# Altium project FPGA_Rack_v1_0.PrjPcb (part 2 of 2)

## Sheet Memory.SCHDOC: FPGA Rack
size 420 x 297 mm; DrawnBy: zas; Revision: V1.0; SheetNumber: 8; SheetTotal: 25; DocumentName: Memory.SCHDOC
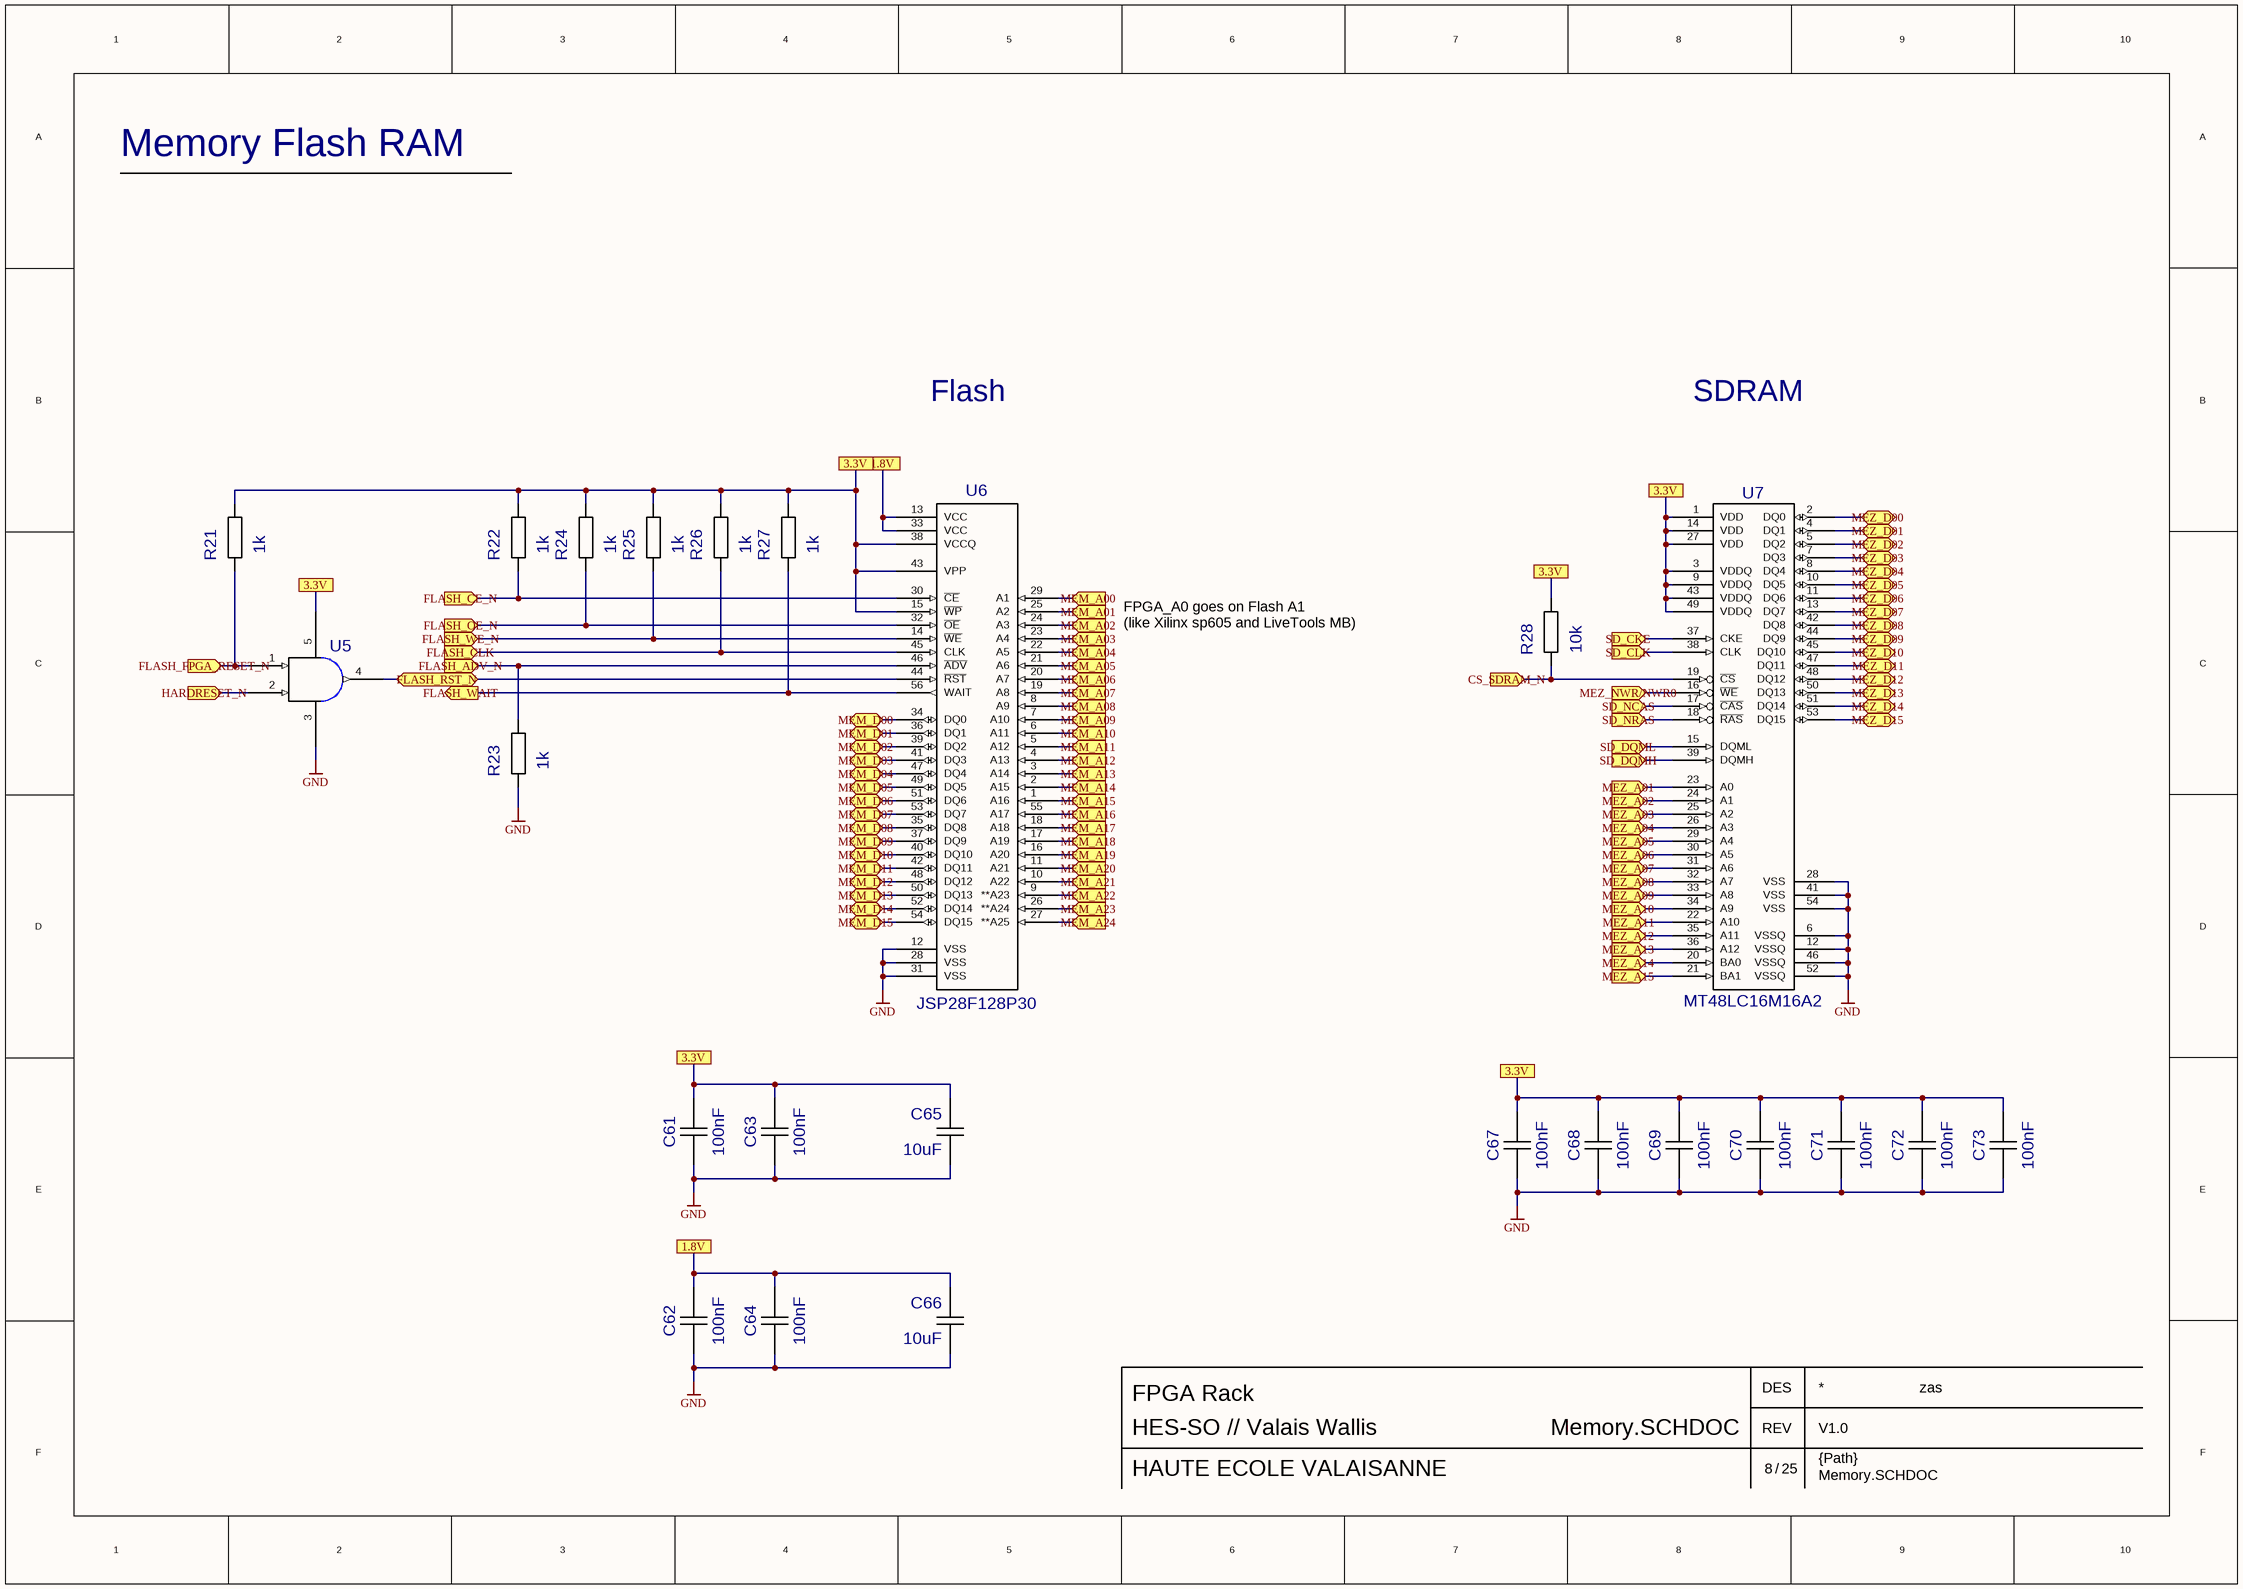
[diagram p8: Memory.SCHDOC]

### Parts
C61  value 100nF  [CC0805-MM]  (hidden comment: CAPS0805-MM)
C62  value 100nF  [CC0805-MM]  (hidden comment: CAPS0805-MM)
C63  value 100nF  [CC0805-MM]  (hidden comment: CAPS0805-MM)
C64  value 100nF  [CC0805-MM]  (hidden comment: CAPS0805-MM)
C65  value 10uF  [CC0805-MM]  (hidden comment: CAPS0805-MM)
C66  value 10uF  [CC0805-MM]  (hidden comment: CAPS0805-MM)
C67  value 100nF  [CC0805-MM]  (hidden comment: CAPS0805-MM)
C68  value 100nF  [CC0805-MM]  (hidden comment: CAPS0805-MM)
C69  value 100nF  [CC0805-MM]  (hidden comment: CAPS0805-MM)
C70  value 100nF  [CC0805-MM]  (hidden comment: CAPS0805-MM)
C71  value 100nF  [CC0805-MM]  (hidden comment: CAPS0805-MM)
C72  value 100nF  [CC0805-MM]  (hidden comment: CAPS0805-MM)
C73  value 100nF  [CC0805-MM]  (hidden comment: CAPS0805-MM)
R21  value 1k  [RC0805-MM]  (hidden comment: RS0805-MM)
R22  value 1k  [RC0805-MM]  (hidden comment: RS0805-MM)
R23  value 1k  [RC0805-MM]  (hidden comment: RS0805-MM)
R24  value 1k  [RC0805-MM]  (hidden comment: RS0805-MM)
R25  value 1k  [RC0805-MM]  (hidden comment: RS0805-MM)
R26  value 1k  [RC0805-MM]  (hidden comment: RS0805-MM)
R27  value 1k  [RC0805-MM]  (hidden comment: RS0805-MM)
R28  value 10k  [RC0805-MM]  (hidden comment: RS0805-MM)
U5  NC7SZ08P5  [SC70-5]  (value not drawn)
U6  value JSP28F128P30  [TSOP56]  (hidden comment: JS28F512P30)
U7  MT48LC16M16A2  [TSOP54]

### Ports
1.8V, 3.3V, CS_SDRAM_N (in), FLASH_ADV_N (in), FLASH_CE_N (in), FLASH_CLK (in), FLASH_FPGA_RESET_N (in), FLASH_OE_N (in), FLASH_RST_N (bidir), FLASH_WAIT (out), FLASH_WE_N (in), HARDRESET_N (in), MEM_A00 (in), MEM_A01 (in), MEM_A02 (in), MEM_A03 (in), MEM_A04 (in), MEM_A05 (in), MEM_A06 (in), MEM_A07 (in), MEM_A08 (in), MEM_A09 (in), MEM_A10 (in), MEM_A11 (in), MEM_A12 (in), MEM_A13 (in), MEM_A14 (in), MEM_A15 (in), MEM_A16 (in), MEM_A17 (in), MEM_A18 (in), MEM_A19 (in), MEM_A20 (in), MEM_A21 (in), MEM_A22 (in), MEM_A23 (in), MEM_A24 (in), MEM_D00 (bidir), MEM_D01 (bidir), MEM_D02 (bidir), MEM_D03 (bidir), MEM_D04 (bidir), MEM_D05 (bidir), MEM_D06 (bidir), MEM_D07 (bidir), MEM_D08 (bidir), MEM_D09 (bidir), MEM_D10 (bidir), MEM_D11 (bidir), MEM_D12 (bidir), MEM_D13 (bidir), MEM_D14 (bidir), MEM_D15 (bidir), MEZ_A01 (in), MEZ_A02 (in), MEZ_A03 (in), MEZ_A04 (in), MEZ_A05 (in), MEZ_A06 (in), MEZ_A07 (in), MEZ_A08 (in), MEZ_A09 (in), MEZ_A10 (in), MEZ_A11 (in), MEZ_A12 (in), MEZ_A13 (in), MEZ_A14 (in), MEZ_A15 (in), MEZ_D00 (bidir), MEZ_D01 (bidir), MEZ_D02 (bidir), MEZ_D03 (bidir), MEZ_D04 (bidir), MEZ_D05 (bidir), MEZ_D06 (bidir), MEZ_D07 (bidir), MEZ_D08 (bidir), MEZ_D09 (bidir), MEZ_D10 (bidir), MEZ_D11 (bidir), MEZ_D12 (bidir), MEZ_D13 (bidir), MEZ_D14 (bidir), MEZ_D15 (bidir), MEZ_NWR/NWR0 (in), SD_CKE (in), SD_CLK (in), SD_DQMH (in), SD_DQML (in), SD_NCAS (in), SD_NRAS (in)

### Nets
GND: C61.1 C62.1 C63.1 C64.1 C65.1 C66.1 C67.1 C68.1 C69.1 C70.1 C71.1 C72.1 C73.1 R23.1 U5.3(GND) U6.12(VSS) U6.28(VSS) U6.31(VSS) U7.6(VSSQ) U7.12(VSSQ) U7.28(VSS) U7.41(VSS) U7.46(VSSQ) U7.52(VSSQ) U7.54(VSS)
CS_SDRAM_N: R28.1 U7.19(~{CS}) ; port CS_SDRAM_N
FLASH_ADV_N: R23.2 U6.46(~{ADV}) ; port FLASH_ADV_N
FLASH_CE_N: R22.1 U6.30(~{CE}) ; port FLASH_CE_N
FLASH_CLK: R26.1 U6.45(CLK) ; port FLASH_CLK
FLASH_FPGA_RESET_N: R21.1 U5.1(A) ; port FLASH_FPGA_RESET_N
FLASH_OE_N: R24.1 U6.32(~{OE}) ; port FLASH_OE_N
FLASH_RST_N: U5.4(Y) U6.44(~{RST}) ; port FLASH_RST_N
FLASH_WAIT: R27.1 U6.56(WAIT) ; port FLASH_WAIT
FLASH_WE_N: R25.1 U6.14(~{WE}) ; port FLASH_WE_N
HARDRESET_N: U5.2(B) ; port HARDRESET_N
MEM_A00: U6.29(A1) ; port MEM_A00
MEM_A01: U6.25(A2) ; port MEM_A01
MEM_A02: U6.24(A3) ; port MEM_A02
MEM_A03: U6.23(A4) ; port MEM_A03
MEM_A04: U6.22(A5) ; port MEM_A04
MEM_A05: U6.21(A6) ; port MEM_A05
MEM_A06: U6.20(A7) ; port MEM_A06
MEM_A07: U6.19(A8) ; port MEM_A07
MEM_A08: U6.8(A9) ; port MEM_A08
MEM_A09: U6.7(A10) ; port MEM_A09
MEM_A10: U6.6(A11) ; port MEM_A10
MEM_A11: U6.5(A12) ; port MEM_A11
MEM_A12: U6.4(A13) ; port MEM_A12
MEM_A13: U6.3(A14) ; port MEM_A13
MEM_A14: U6.2(A15) ; port MEM_A14
MEM_A15: U6.1(A16) ; port MEM_A15
MEM_A16: U6.55(A17) ; port MEM_A16
MEM_A17: U6.18(A18) ; port MEM_A17
MEM_A18: U6.17(A19) ; port MEM_A18
MEM_A19: U6.16(A20) ; port MEM_A19
MEM_A20: U6.11(A21) ; port MEM_A20
MEM_A21: U6.10(A22) ; port MEM_A21
MEM_A22: U6.9(**A23) ; port MEM_A22
MEM_A23: U6.26(**A24) ; port MEM_A23
MEM_A24: U6.27(**A25) ; port MEM_A24
MEM_D00: U6.34(DQ0) ; port MEM_D00
MEM_D01: U6.36(DQ1) ; port MEM_D01
MEM_D02: U6.39(DQ2) ; port MEM_D02
MEM_D03: U6.41(DQ3) ; port MEM_D03
MEM_D04: U6.47(DQ4) ; port MEM_D04
MEM_D05: U6.49(DQ5) ; port MEM_D05
MEM_D06: U6.51(DQ6) ; port MEM_D06
MEM_D07: U6.53(DQ7) ; port MEM_D07
MEM_D08: U6.35(DQ8) ; port MEM_D08
MEM_D09: U6.37(DQ9) ; port MEM_D09
MEM_D10: U6.40(DQ10) ; port MEM_D10
MEM_D11: U6.42(DQ11) ; port MEM_D11
MEM_D12: U6.48(DQ12) ; port MEM_D12
MEM_D13: U6.50(DQ13) ; port MEM_D13
MEM_D14: U6.52(DQ14) ; port MEM_D14
MEM_D15: U6.54(DQ15) ; port MEM_D15
MEZ_A01: U7.23(A0) ; port MEZ_A01
MEZ_A02: U7.24(A1) ; port MEZ_A02
MEZ_A03: U7.25(A2) ; port MEZ_A03
MEZ_A04: U7.26(A3) ; port MEZ_A04
MEZ_A05: U7.29(A4) ; port MEZ_A05
MEZ_A06: U7.30(A5) ; port MEZ_A06
MEZ_A07: U7.31(A6) ; port MEZ_A07
MEZ_A08: U7.32(A7) ; port MEZ_A08
MEZ_A09: U7.33(A8) ; port MEZ_A09
MEZ_A10: U7.34(A9) ; port MEZ_A10
MEZ_A11: U7.22(A10) ; port MEZ_A11
MEZ_A12: U7.35(A11) ; port MEZ_A12
MEZ_A13: U7.36(A12) ; port MEZ_A13
MEZ_A14: U7.20(BA0) ; port MEZ_A14
MEZ_A15: U7.21(BA1) ; port MEZ_A15
MEZ_D00: U7.2(DQ0) ; port MEZ_D00
MEZ_D01: U7.4(DQ1) ; port MEZ_D01
MEZ_D02: U7.5(DQ2) ; port MEZ_D02
MEZ_D03: U7.7(DQ3) ; port MEZ_D03
MEZ_D04: U7.8(DQ4) ; port MEZ_D04
MEZ_D05: U7.10(DQ5) ; port MEZ_D05
MEZ_D06: U7.11(DQ6) ; port MEZ_D06
MEZ_D07: U7.13(DQ7) ; port MEZ_D07
MEZ_D08: U7.42(DQ8) ; port MEZ_D08
MEZ_D09: U7.44(DQ9) ; port MEZ_D09
MEZ_D10: U7.45(DQ10) ; port MEZ_D10
MEZ_D11: U7.47(DQ11) ; port MEZ_D11
MEZ_D12: U7.48(DQ12) ; port MEZ_D12
MEZ_D13: U7.50(DQ13) ; port MEZ_D13
MEZ_D14: U7.51(DQ14) ; port MEZ_D14
MEZ_D15: U7.53(DQ15) ; port MEZ_D15
MEZ_NWR/NWR0: U7.16(~{WE}) ; port MEZ_NWR/NWR0
SD_CKE: U7.37(CKE) ; port SD_CKE
SD_CLK: U7.38(CLK) ; port SD_CLK
SD_DQMH: U7.39(DQMH) ; port SD_DQMH
SD_DQML: U7.15(DQML) ; port SD_DQML
SD_NCAS: U7.17(~{CAS}) ; port SD_NCAS
SD_NRAS: U7.18(~{RAS}) ; port SD_NRAS
NetC61_2: C61.2 C63.2 C65.2
NetC62_2: C62.2 C64.2 C66.2
NetC67_2: C67.2 C68.2 C69.2 C70.2 C71.2 C72.2 C73.2
NetR21_2: R21.2 R22.2 R24.2 R25.2 R26.2 R27.2 U6.15(~{WP}) U6.38(VCCQ) U6.43(VPP)
NetU6_13: U6.13(VCC) U6.33(VCC)
NetU7_1: U7.1(VDD) U7.3(VDDQ) U7.9(VDDQ) U7.14(VDD) U7.27(VDD) U7.43(VDDQ) U7.49(VDDQ)

Not connected (* = marked no-connect by the designer): R28 2; U5 5(VCC); U7 40(NC)

### Notes on the sheet
- Memory Flash RAM
- Flash
- SDRAM
- FPGA_A0 goes on Flash A1
  (like Xilinx sp605 and LiveTools MB)
- DES
- HES-SO // Valais Wallis
- HAUTE ECOLE VALAISANNE
- /
- REV
- {Path}

### Library data of the parts
C61-C64 C67-C73 = CAPS0805-MM: Capacitor; Partition: FPGA; RefDes2: {RefDes2}; MEZZAONLY: YES
C65 C66 = CAPS0805-MM: Capacitor
R21-R28 = RS0805-MM: Partition: RAM; RefDes2: {RefDes2}; MEZZAONLY: YES
U5 = NC7SZ08P5: HS Inverter - Fairchild
U6 = JS28F512P30: SDRAM 64Mb x 16 - Micron
U7 = MT48LC16M16A2: SDRAM 64Mb x 16 - Micron; Value: *

## Sheet Mezzanine.SCHDOC: FPGA Rack
size 420 x 297 mm; DrawnBy: zas; Revision: V1.0; SheetNumber: 9; SheetTotal: 25; DocumentName: Mezzanine.SCHDOC
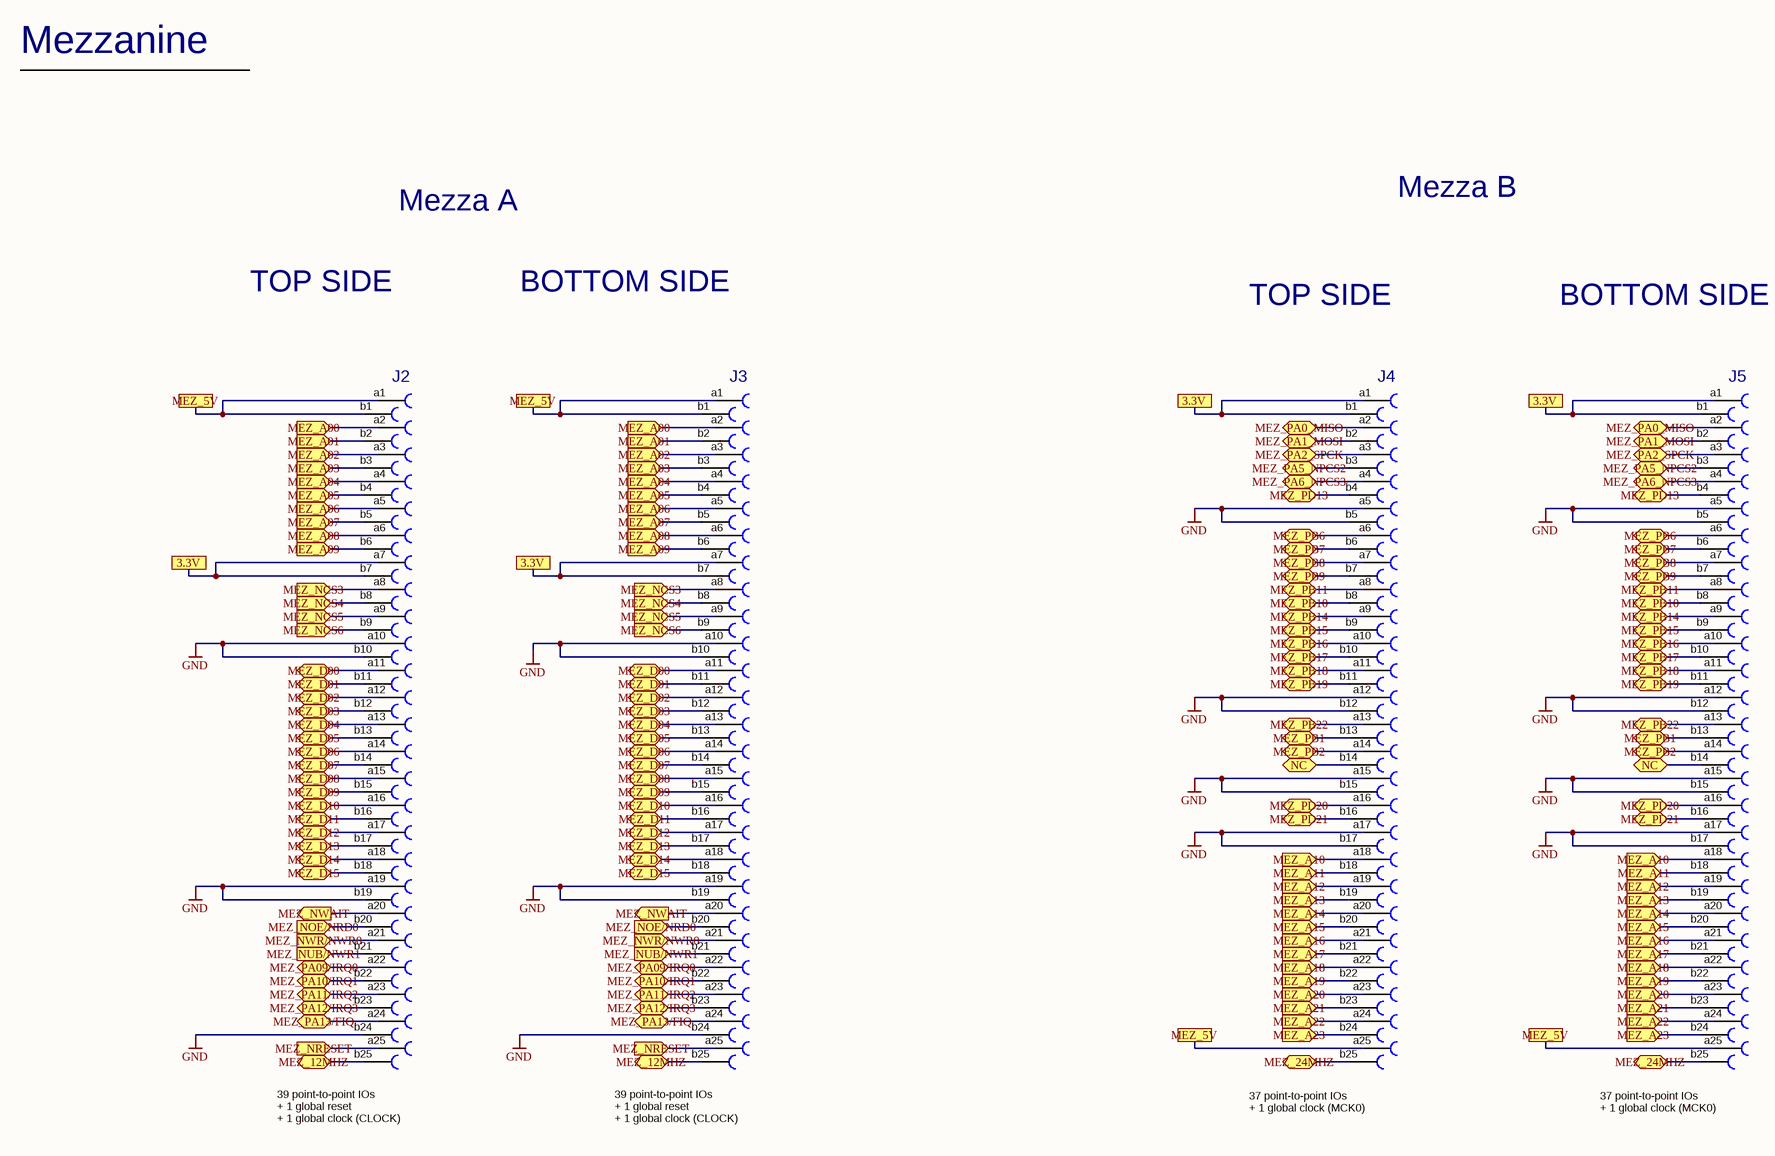
[diagram p9: Mezzanine.SCHDOC]

### Parts
J2  ERNI-SMC-50P-FD  [ERNI-SMC-50P-FD]  (value not drawn)
J3  ERNI-SMC-50P-MD  [ERNI-SMC-50P-MD]  (value not drawn)
J4  ERNI-SMC-50P-FD  [ERNI-SMC-50P-FD]  (value not drawn)
J5  ERNI-SMC-50P-MD  [ERNI-SMC-50P-MD]  (value not drawn)

### Ports
3.3V, MEZ_5V, MEZ_12MHZ (bidir), MEZ_24MHZ (bidir), MEZ_A00 (in), MEZ_A01 (in), MEZ_A02 (in), MEZ_A03 (in), MEZ_A04 (in), MEZ_A05 (in), MEZ_A06 (in), MEZ_A07 (in), MEZ_A08 (in), MEZ_A09 (in), MEZ_A10 (in), MEZ_A11 (in), MEZ_A12 (in), MEZ_A13 (in), MEZ_A14 (in), MEZ_A15 (in), MEZ_A16 (in), MEZ_A17 (in), MEZ_A18 (in), MEZ_A19 (in), MEZ_A20 (in), MEZ_A21 (in), MEZ_A22 (in), MEZ_A23 (in), MEZ_D00 (bidir), MEZ_D01 (bidir), MEZ_D02 (bidir), MEZ_D03 (bidir), MEZ_D04 (bidir), MEZ_D05 (bidir), MEZ_D06 (bidir), MEZ_D07 (bidir), MEZ_D08 (bidir), MEZ_D09 (bidir), MEZ_D10 (bidir), MEZ_D11 (bidir), MEZ_D12 (bidir), MEZ_D13 (bidir), MEZ_D14 (bidir), MEZ_D15 (bidir), MEZ_NCS3 (in), MEZ_NCS4 (in), MEZ_NCS5 (in), MEZ_NCS6 (in), MEZ_NOE/NRD0 (in), MEZ_NRESET (in), MEZ_NUB/NWR1 (in), MEZ_NWAIT (out), MEZ_NWR/NWR0 (in), MEZ_PA0_MISO (bidir), MEZ_PA1_MOSI (bidir), MEZ_PA2_SPCK (bidir), MEZ_PA5_NPCS2 (bidir), MEZ_PA6_NPCS3 (bidir), MEZ_PA09/IRQ0 (bidir), MEZ_PA10/IRQ1 (bidir), MEZ_PA11/IRQ2 (bidir), MEZ_PA12/IRQ3 (bidir), MEZ_PA13/FIQ (bidir), MEZ_PB1 (bidir), MEZ_PB2 (bidir), MEZ_PB6 (bidir), MEZ_PB7 (bidir), MEZ_PB8 (bidir), MEZ_PB9 (bidir), MEZ_PB10 (bidir), MEZ_PB11 (bidir), MEZ_PB14 (bidir), MEZ_PB15 (bidir), MEZ_PB16 (bidir), MEZ_PB17 (bidir), MEZ_PB18 (bidir), MEZ_PB19 (bidir), MEZ_PB22 (bidir), MEZ_PD13 (bidir), MEZ_PD20 (bidir), MEZ_PD21 (bidir), NC (bidir)

### Nets
GND: J2.a10 J2.a19 J2.b10 J2.b19 J2.b24 J3.a10 J3.a19 J3.b10 J3.b19 J3.b24 J4.a5 J4.a12 J4.a15 J4.a17 J4.b5 J4.b12 J4.b15 J4.b17 J5.a5 J5.a12 J5.a15 J5.a17 J5.b5 J5.b12 J5.b15 J5.b17
MEZ_12MHZ: J2.b25 J3.b25 ; port MEZ_12MHZ
MEZ_24MHZ: J4.b25 J5.b25 ; port MEZ_24MHZ
MEZ_A00: J2.a2 J3.a2 ; port MEZ_A00
MEZ_A01: J2.b2 J3.b2 ; port MEZ_A01
MEZ_A02: J2.a3 J3.a3 ; port MEZ_A02
MEZ_A03: J2.b3 J3.b3 ; port MEZ_A03
MEZ_A04: J2.a4 J3.a4 ; port MEZ_A04
MEZ_A05: J2.b4 J3.b4 ; port MEZ_A05
MEZ_A06: J2.a5 J3.a5 ; port MEZ_A06
MEZ_A07: J2.b5 J3.b5 ; port MEZ_A07
MEZ_A08: J2.a6 J3.a6 ; port MEZ_A08
MEZ_A09: J2.b6 J3.b6 ; port MEZ_A09
MEZ_A10: J4.a18 J5.a18 ; port MEZ_A10
MEZ_A11: J4.b18 J5.b18 ; port MEZ_A11
MEZ_A12: J4.a19 J5.a19 ; port MEZ_A12
MEZ_A13: J4.b19 J5.b19 ; port MEZ_A13
MEZ_A14: J4.a20 J5.a20 ; port MEZ_A14
MEZ_A15: J4.b20 J5.b20 ; port MEZ_A15
MEZ_A16: J4.a21 J5.a21 ; port MEZ_A16
MEZ_A17: J4.b21 J5.b21 ; port MEZ_A17
MEZ_A18: J4.a22 J5.a22 ; port MEZ_A18
MEZ_A19: J4.b22 J5.b22 ; port MEZ_A19
MEZ_A20: J4.a23 J5.a23 ; port MEZ_A20
MEZ_A21: J4.b23 J5.b23 ; port MEZ_A21
MEZ_A22: J4.a24 J5.a24 ; port MEZ_A22
MEZ_A23: J4.b24 J5.b24 ; port MEZ_A23
MEZ_D00: J2.a11 J3.a11 ; port MEZ_D00
MEZ_D01: J2.b11 J3.b11 ; port MEZ_D01
MEZ_D02: J2.a12 J3.a12 ; port MEZ_D02
MEZ_D03: J2.b12 J3.b12 ; port MEZ_D03
MEZ_D04: J2.a13 J3.a13 ; port MEZ_D04
MEZ_D05: J2.b13 J3.b13 ; port MEZ_D05
MEZ_D06: J2.a14 J3.a14 ; port MEZ_D06
MEZ_D07: J2.b14 J3.b14 ; port MEZ_D07
MEZ_D08: J2.a15 J3.a15 ; port MEZ_D08
MEZ_D09: J2.b15 J3.b15 ; port MEZ_D09
MEZ_D10: J2.a16 J3.a16 ; port MEZ_D10
MEZ_D11: J2.b16 J3.b16 ; port MEZ_D11
MEZ_D12: J2.a17 J3.a17 ; port MEZ_D12
MEZ_D13: J2.b17 J3.b17 ; port MEZ_D13
MEZ_D14: J2.a18 J3.a18 ; port MEZ_D14
MEZ_D15: J2.b18 J3.b18 ; port MEZ_D15
MEZ_NCS3: J2.a8 J3.a8 ; port MEZ_NCS3
MEZ_NCS4: J2.b8 J3.b8 ; port MEZ_NCS4
MEZ_NCS5: J2.a9 J3.a9 ; port MEZ_NCS5
MEZ_NCS6: J2.b9 J3.b9 ; port MEZ_NCS6
MEZ_NOE/NRD0: J2.b20 J3.b20 ; port MEZ_NOE/NRD0
MEZ_NRESET: J2.a25 J3.a25 ; port MEZ_NRESET
MEZ_NUB/NWR1: J2.b21 J3.b21 ; port MEZ_NUB/NWR1
MEZ_NWAIT: J2.a20 J3.a20 ; port MEZ_NWAIT
MEZ_NWR/NWR0: J2.a21 J3.a21 ; port MEZ_NWR/NWR0
MEZ_PA0_MISO: J4.a2 J5.a2 ; port MEZ_PA0_MISO
MEZ_PA1_MOSI: J4.b2 J5.b2 ; port MEZ_PA1_MOSI
MEZ_PA2_SPCK: J4.a3 J5.a3 ; port MEZ_PA2_SPCK
MEZ_PA5_NPCS2: J4.b3 J5.b3 ; port MEZ_PA5_NPCS2
MEZ_PA6_NPCS3: J4.a4 J5.a4 ; port MEZ_PA6_NPCS3
MEZ_PA09/IRQ0: J2.a22 J3.a22 ; port MEZ_PA09/IRQ0
MEZ_PA10/IRQ1: J2.b22 J3.b22 ; port MEZ_PA10/IRQ1
MEZ_PA11/IRQ2: J2.a23 J3.a23 ; port MEZ_PA11/IRQ2
MEZ_PA12/IRQ3: J2.b23 J3.b23 ; port MEZ_PA12/IRQ3
MEZ_PA13/FIQ: J2.a24 J3.a24 ; port MEZ_PA13/FIQ
MEZ_PB1: J4.b13 J5.b13 ; port MEZ_PB1
MEZ_PB2: J4.a14 J5.a14 ; port MEZ_PB2
MEZ_PB6: J4.a6 J5.a6 ; port MEZ_PB6
MEZ_PB7: J4.b6 J5.b6 ; port MEZ_PB7
MEZ_PB8: J4.a7 J5.a7 ; port MEZ_PB8
MEZ_PB9: J4.b7 J5.b7 ; port MEZ_PB9
MEZ_PB10: J4.b8 J5.b8 ; port MEZ_PB10
MEZ_PB11: J4.a8 J5.a8 ; port MEZ_PB11
MEZ_PB14: J4.a9 J5.a9 ; port MEZ_PB14
MEZ_PB15: J4.b9 J5.b9 ; port MEZ_PB15
MEZ_PB16: J4.a10 J5.a10 ; port MEZ_PB16
MEZ_PB17: J4.b10 J5.b10 ; port MEZ_PB17
MEZ_PB18: J4.a11 J5.a11 ; port MEZ_PB18
MEZ_PB19: J4.b11 J5.b11 ; port MEZ_PB19
MEZ_PB22: J4.a13 J5.a13 ; port MEZ_PB22
MEZ_PD13: J4.b4 J5.b4 ; port MEZ_PD13
MEZ_PD20: J4.a16 J5.a16 ; port MEZ_PD20
MEZ_PD21: J4.b16 J5.b16 ; port MEZ_PD21
NC: J4.b14 J5.b14 ; port NC
NetJ2_a1: J2.a1 J2.b1
NetJ2_a7: J2.a7 J2.b7
NetJ3_a1: J3.a1 J3.b1
NetJ3_a7: J3.a7 J3.b7
NetJ4_a1: J4.a1 J4.b1
NetJ5_a1: J5.a1 J5.b1

Not connected (* = marked no-connect by the designer): J2 NC1 NC2 NC3 NC4 NC5 NC6; J4 a25(49) NC1 NC2 NC3 NC4 NC5 NC6; J5 a25(49)

### Notes on the sheet
- Mezzanine
- Mezza A
- Mezza B
- TOP SIDE
- BOTTOM SIDE
- (near J2) 39 point-to-point IOs
  + 1 global reset
  + 1 global clock (CLOCK)
- (near J3) 39 point-to-point IOs
  + 1 global reset
  + 1 global clock (CLOCK)
- (near J4) 37 point-to-point IOs
  + 1 global clock (MCK0)
- (near J5) 37 point-to-point IOs
  + 1 global clock (MCK0)
- DES
- HES-SO // Valais Wallis
- HAUTE ECOLE VALAISANNE
- /
- REV
- {Path}

### Library data of the parts
J2 J4 = ERNI-SMC-50P-FD: Connecteur Smd serie SMC pas 1.27 ERNI - Distrelec 12 06 39; partition: Mezzanine; RefDes2: {RefDes2}; MEZZAONLY: YES; Value: *
J3 J5 = ERNI-SMC-50P-MD: Connecteur Smd serie SMC pas 1.27 ERNI - Distrelec 12 06 42; partition: Mezzanine; RefDes2: {RefDes2}; MEZZAONLY: YES; Value: *

## Sheet Ethernet.SCHDOC: FPGA Rack
size 420 x 297 mm; DrawnBy: zas; Revision: V1.0; SheetNumber: 11; SheetTotal: 25; DocumentName: Ethernet.SCHDOC
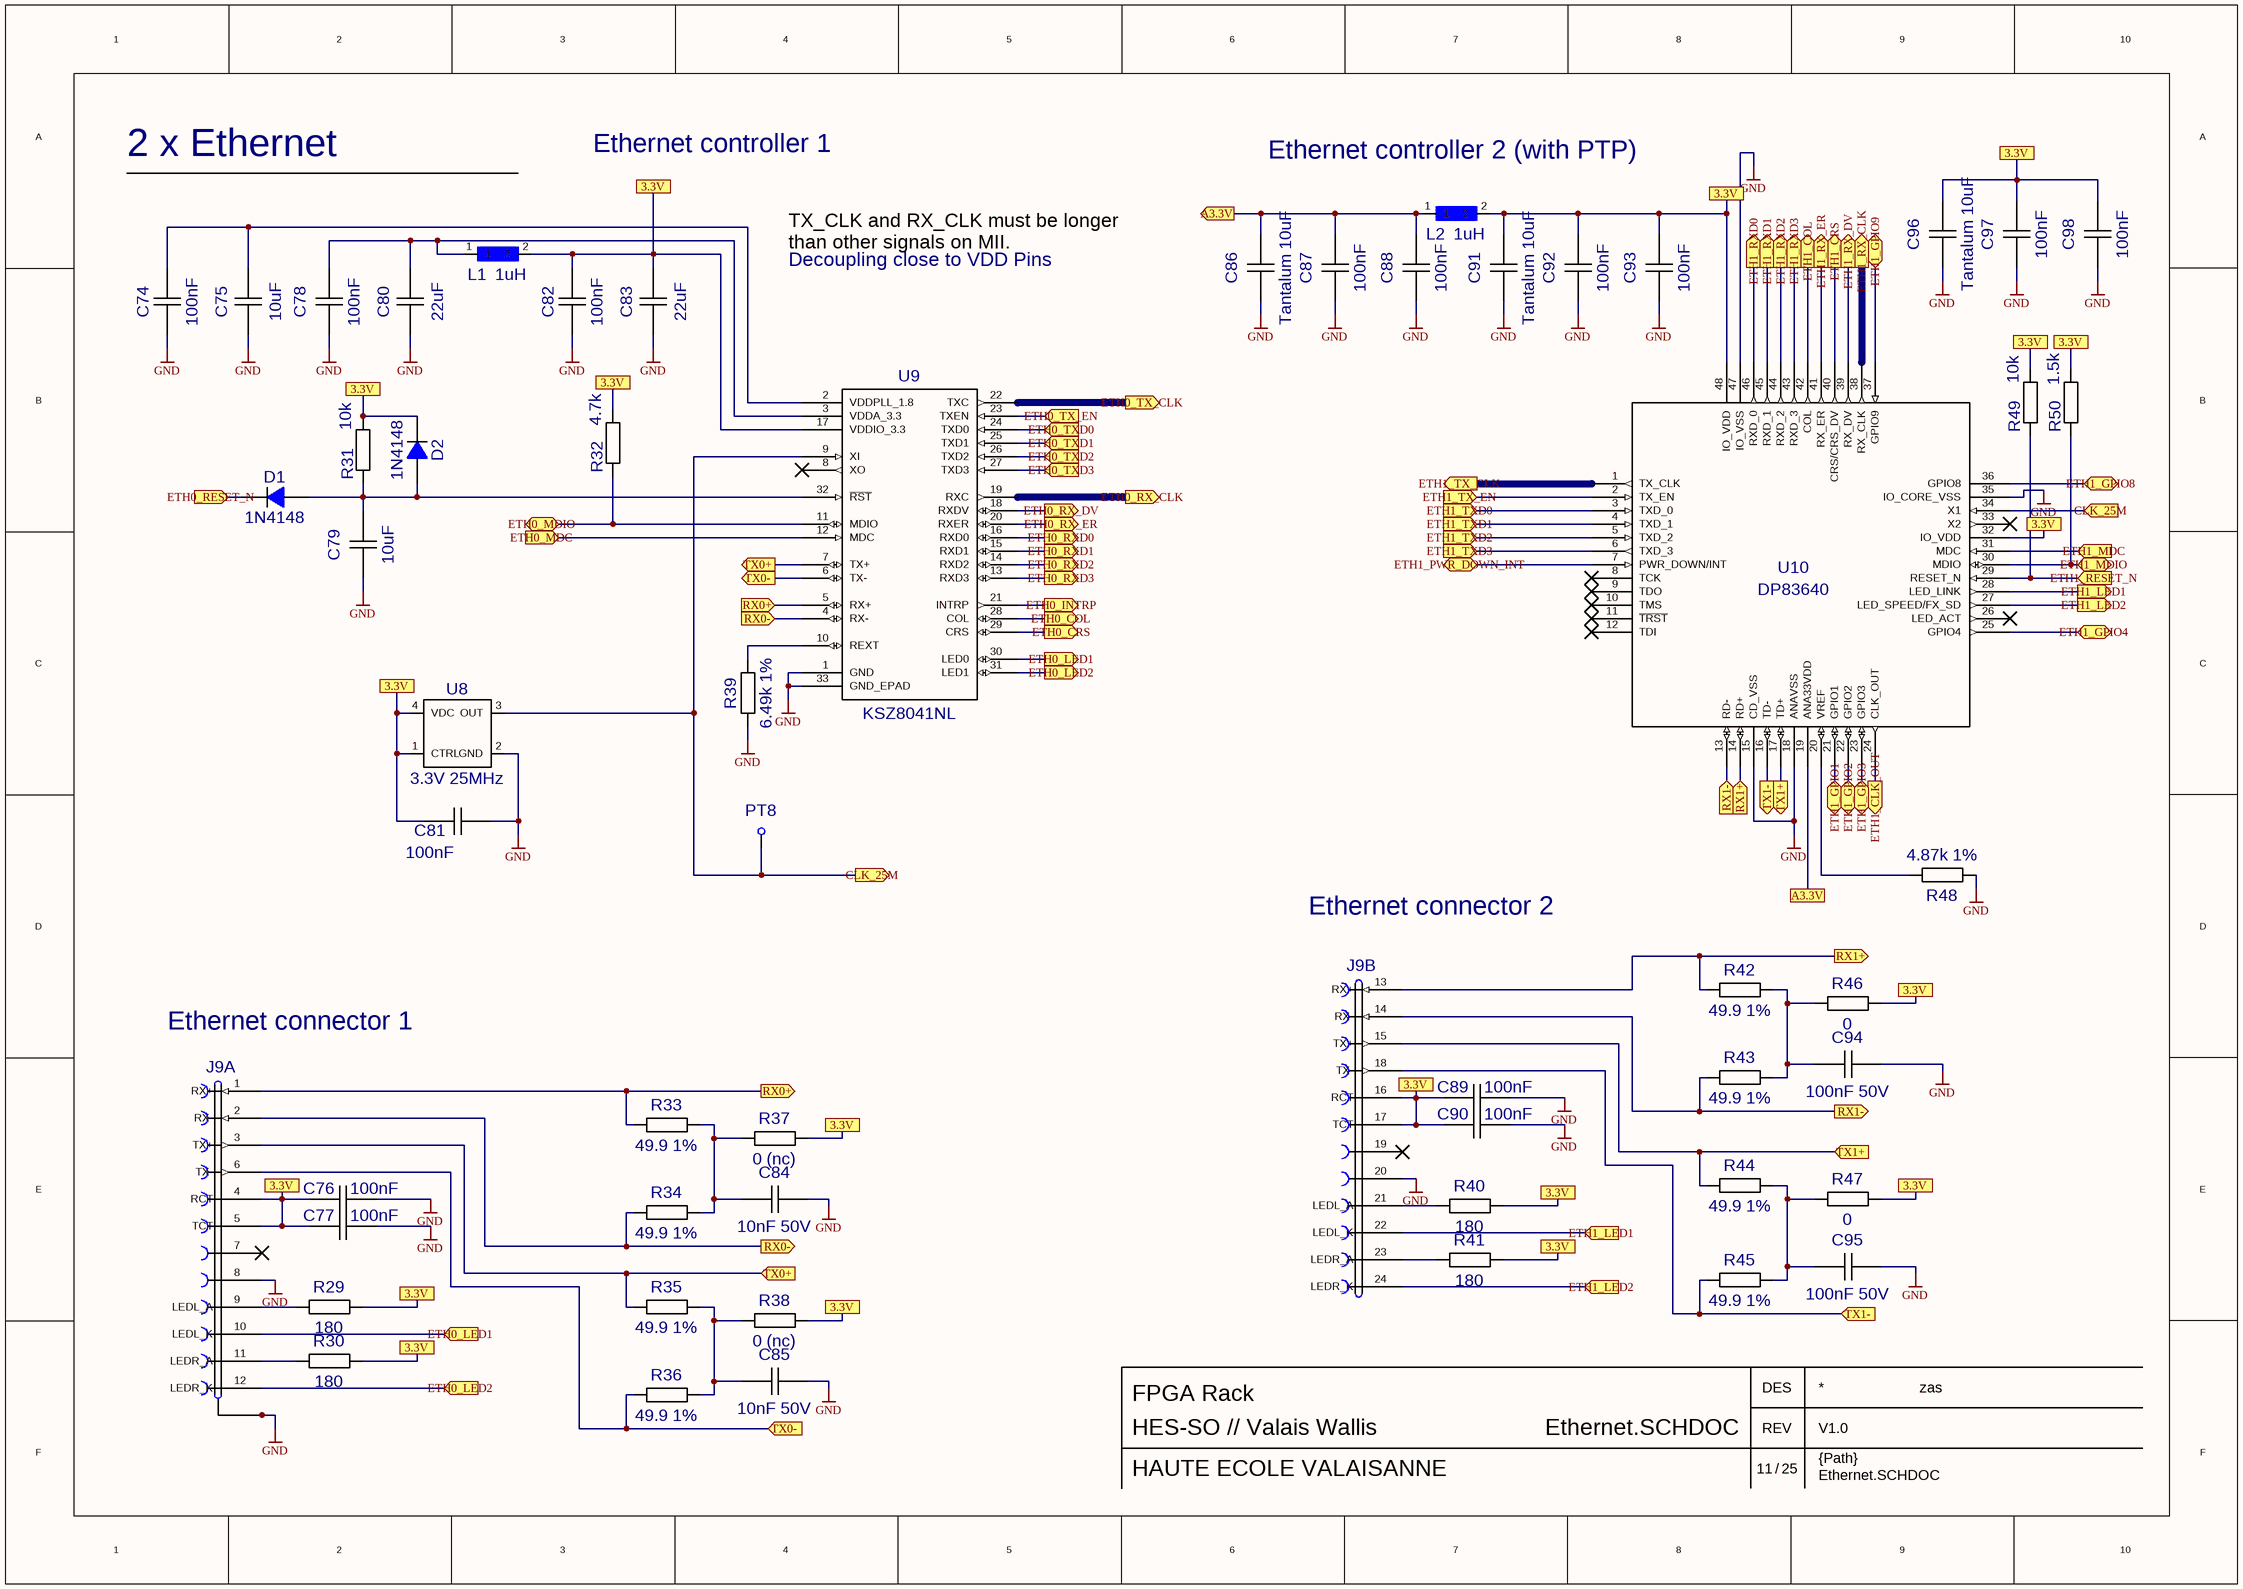
[diagram p10: Ethernet.SCHDOC]

### Parts
C74  value 100nF  [CC0805-MM]  (hidden comment: CAPS0805-MM)
C75  value 10uF  [CC0805-MM]  (hidden comment: CAPS0805-MM)
C76  value 100nF  [CC0805-MM]  (hidden comment: CAPS0805-MM)
C77  value 100nF  [CC0805-MM]  (hidden comment: CAPS0805-MM)
C78  value 100nF  [CC0805-MM]  (hidden comment: CAPS0805-MM)
C79  value 10uF  [CC0805-MM]  (hidden comment: CAPS0805-MM)
C80  value 22uF  [CC1206-MM]  (hidden comment: CAPS1206-MM)
C81  value 100nF  [CC0805-MM]  (hidden comment: CAPS0805-MM)
C82  value 100nF  [CC0805-MM]  (hidden comment: CAPS0805-MM)
C83  value 22uF  [CC1206-MM]  (hidden comment: CAPS1206-MM)
C84  value 10nF 50V  [CC0805-MM]  (hidden comment: CAPS0805-MM)
C85  value 10nF 50V  [CC0805-MM]  (hidden comment: CAPS0805-MM)
C86  value Tantalum 10uF  [CC0805-MM]  (hidden comment: CAPS0805-MM)
C87  value 100nF  [CC0805-MM]  (hidden comment: CAPS0805-MM)
C88  value 100nF  [CC0805-MM]  (hidden comment: CAPS0805-MM)
C89  value 100nF  [CC0805-MM]  (hidden comment: CAPS0805-MM)
C90  value 100nF  [CC0805-MM]  (hidden comment: CAPS0805-MM)
C91  value Tantalum 10uF  [CC0805-MM]  (hidden comment: CAPS0805-MM)
C92  value 100nF  [CC0805-MM]  (hidden comment: CAPS0805-MM)
C93  value 100nF  [CC0805-MM]  (hidden comment: CAPS0805-MM)
C94  value 100nF 50V  [CC0805-MM]  (hidden comment: CAPS0805-MM)
C95  value 100nF 50V  [CC0805-MM]  (hidden comment: CAPS0805-MM)
C96  value Tantalum 10uF  [CC0805-MM]  (hidden comment: CAPS0805-MM)
C97  value 100nF  [CC0805-MM]  (hidden comment: CAPS0805-MM)
C98  value 100nF  [CC0805-MM]  (hidden comment: CAPS0805-MM)
D1  value 1N4148  [SOT23]  (hidden comment: BAS16)
D2  value 1N4148  [SOT23]  (hidden comment: BAS16)
J9  RJ45-PULSE-J8064D628ANL  [RJ45-PULSE-J8064D628ANL]  (value not drawn)  (parts A,B of 2)
L1  value 1uH  [L0805-MM]  (hidden comment: L-0805-MM)
L2  value 1uH  [L0805-MM]  (hidden comment: L-0805-MM)
PT8  PTEST  [CONN1X1M]  (value not drawn)
R29  value 180  [RC0805-MM]  (hidden comment: RS0805-MM)
R30  value 180  [RC0805-MM]  (hidden comment: RS0805-MM)
R31  value 10k  [RC0805-MM]  (hidden comment: RS0805-MM)
R32  value 4.7k  [RC0805-MM]  (hidden comment: RS0805-MM)
R33  value 49.9 1%  [RC0805-MM]  (hidden comment: RS0805-MM)
R34  value 49.9 1%  [RC0805-MM]  (hidden comment: RS0805-MM)
R35  value 49.9 1%  [RC0805-MM]  (hidden comment: RS0805-MM)
R36  value 49.9 1%  [RC0805-MM]  (hidden comment: RS0805-MM)
R37  value 0 (nc)  [RC0805-MM]  (hidden comment: RS0805-MM)
R38  value 0 (nc)  [RC0805-MM]  (hidden comment: RS0805-MM)
R39  value 6.49k 1%  [RC0805-MM]  (hidden comment: RS0805-MM)
R40  value 180  [RC0805-MM]  (hidden comment: RS0805-MM)
R41  value 180  [RC0805-MM]  (hidden comment: RS0805-MM)
R42  value 49.9 1%  [RC0805-MM]  (hidden comment: RS0805-MM)
R43  value 49.9 1%  [RC0805-MM]  (hidden comment: RS0805-MM)
R44  value 49.9 1%  [RC0805-MM]  (hidden comment: RS0805-MM)
R45  value 49.9 1%  [RC0805-MM]  (hidden comment: RS0805-MM)
R46  value 0  [RC0805-MM]  (hidden comment: RS0805-MM)
R47  value 0  [RC0805-MM]  (hidden comment: RS0805-MM)
R48  value 4.87k 1%  [RC0805-MM]  (hidden comment: RS0805-MM)
R49  value 10k  [RC0805-MM]  (hidden comment: RS0805-MM)
R50  value 1.5k  [RC0805-MM]  (hidden comment: RS0805-MM)
U8  value 3.3V 25MHz  [OSCILL-VX3]  (hidden comment: OSCILL-VX3)
U9  KSZ8041NL  [QFN32 5X5]
U10  DP83640  [LQFP48-P0.5-L7-C7]

### Ports
3.3V, A3.3V, A3.3V (out), CLK_25M (in), CLK_25M (out), ETH0_COL (out), ETH0_CRS (out), ETH0_INTRP (out), ETH0_LED1 (in), ETH0_LED1 (out), ETH0_LED2 (in), ETH0_LED2 (out), ETH0_MDC (in), ETH0_MDIO (bidir), ETH0_RESET_N (in), ETH0_RX_CLK (out), ETH0_RX_DV (out), ETH0_RX_ER (out), ETH0_RXD0 (out), ETH0_RXD1 (out), ETH0_RXD2 (out), ETH0_RXD3 (out), ETH0_TX_CLK (out), ETH0_TX_EN (in), ETH0_TXD0 (in), ETH0_TXD1 (in), ETH0_TXD2 (in), ETH0_TXD3 (in), ETH1_CLK_OUT (out), ETH1_COL (out), ETH1_CRS (out), ETH1_GPIO1 (bidir), ETH1_GPIO2 (bidir), ETH1_GPIO3 (bidir), ETH1_GPIO4 (bidir), ETH1_GPIO8 (bidir), ETH1_GPIO9 (bidir), ETH1_LED1 (in), ETH1_LED1 (out), ETH1_LED2 (in), ETH1_LED2 (out), ETH1_MDC (in), ETH1_MDIO (bidir), ETH1_PWR_DOWN_INT (bidir), ETH1_RESET_N (in), ETH1_RX_CLK (out), ETH1_RX_DV (out), ETH1_RX_ER (out), ETH1_RXD0 (out), ETH1_RXD1 (out), ETH1_RXD2 (out), ETH1_RXD3 (out), ETH1_TX_CLK (out), ETH1_TX_EN (in), ETH1_TXD0 (in), ETH1_TXD1 (in), ETH1_TXD2 (in), ETH1_TXD3 (in), RX0+ (in), RX0+ (out), RX0- (in), RX0- (out), RX1+ (in), RX1+ (out), RX1- (in), RX1- (out), TX0+ (in), TX0+ (out), TX0- (in), TX0- (out), TX1+ (in), TX1+ (out), TX1- (in), TX1- (out)

### Nets
GND: C74.1 C75.1 C76.2 C77.2 C78.1 C79.1 C80.1 C81.2 C82.1 C83.1 C84.2 C85.2 C86.1 C87.1 C88.1 C89.2 C90.2 C91.1 C92.1 C93.1 C94.2 C95.2 C96.1 C97.1 C98.1 J9.8 J9.20 J9.25 J9.26 J9.27 R39.1 R48.1 U8.2(GND) U9.1(GND) U9.33(GND_EPAD) U10.15(CD_VSS) U10.18(ANAVSS) U10.35(IO_CORE_VSS) U10.47(IO_VSS)
A3.3V: C86.2 C87.2 C88.2 L2.1 ; port A3.3V
CLK_25M: PT8.1(A) U8.3(OUT) U9.9(XI) U10.34(X1) ; port CLK_25M
ETH0_COL: U9.28(COL) ; port ETH0_COL
ETH0_CRS: U9.29(CRS) ; port ETH0_CRS
ETH0_INTRP: U9.21(INTRP) ; port ETH0_INTRP
ETH0_LED1: J9.10(LEDL_K) U9.30(LED0) ; port ETH0_LED1
ETH0_LED2: J9.12(LEDR_K) U9.31(LED1) ; port ETH0_LED2
ETH0_MDC: U9.12(MDC) ; port ETH0_MDC
ETH0_MDIO: R32.1 U9.11(MDIO) ; port ETH0_MDIO
ETH0_RESET_N: D1.3(K) ; port ETH0_RESET_N
ETH0_RX_CLK: U9.19(RXC) ; port ETH0_RX_CLK
ETH0_RX_DV: U9.18(RXDV) ; port ETH0_RX_DV
ETH0_RX_ER: U9.20(RXER) ; port ETH0_RX_ER
ETH0_RXD0: U9.16(RXD0) ; port ETH0_RXD0
ETH0_RXD1: U9.15(RXD1) ; port ETH0_RXD1
ETH0_RXD2: U9.14(RXD2) ; port ETH0_RXD2
ETH0_RXD3: U9.13(RXD3) ; port ETH0_RXD3
ETH0_TX_CLK: U9.22(TXC) ; port ETH0_TX_CLK
ETH0_TX_EN: U9.23(TXEN) ; port ETH0_TX_EN
ETH0_TXD0: U9.24(TXD0) ; port ETH0_TXD0
ETH0_TXD1: U9.25(TXD1) ; port ETH0_TXD1
ETH0_TXD2: U9.26(TXD2) ; port ETH0_TXD2
ETH0_TXD3: U9.27(TXD3) ; port ETH0_TXD3
ETH1_CLK_OUT: U10.24(CLK_OUT) ; port ETH1_CLK_OUT
ETH1_COL: U10.42(COL) ; port ETH1_COL
ETH1_CRS: U10.40(CRS/CRS_DV) ; port ETH1_CRS
ETH1_GPIO1: U10.21(GPIO1) ; port ETH1_GPIO1
ETH1_GPIO2: U10.22(GPIO2) ; port ETH1_GPIO2
ETH1_GPIO3: U10.23(GPIO3) ; port ETH1_GPIO3
ETH1_GPIO4: U10.25(GPIO4) ; port ETH1_GPIO4
ETH1_GPIO8: U10.36(GPIO8) ; port ETH1_GPIO8
ETH1_GPIO9: U10.37(GPIO9) ; port ETH1_GPIO9
ETH1_LED1: J9.22(LEDL_K) U10.28(LED_LINK) ; port ETH1_LED1
ETH1_LED2: J9.24(LEDR_K) U10.27(LED_SPEED/FX_SD) ; port ETH1_LED2
ETH1_MDC: U10.31(MDC) ; port ETH1_MDC
ETH1_MDIO: R50.1 U10.30(MDIO) ; port ETH1_MDIO
ETH1_PWR_DOWN_INT: U10.7(PWR_DOWN/INT) ; port ETH1_PWR_DOWN_INT
ETH1_RESET_N: R49.1 U10.29(RESET_N) ; port ETH1_RESET_N
ETH1_RX_CLK: U10.38(RX_CLK) ; port ETH1_RX_CLK
ETH1_RX_DV: U10.39(RX_DV) ; port ETH1_RX_DV
ETH1_RX_ER: U10.41(RX_ER) ; port ETH1_RX_ER
ETH1_RXD0: U10.46(RXD_0) ; port ETH1_RXD0
ETH1_RXD1: U10.45(RXD_1) ; port ETH1_RXD1
ETH1_RXD2: U10.44(RXD_2) ; port ETH1_RXD2
ETH1_RXD3: U10.43(RXD_3) ; port ETH1_RXD3
ETH1_TX_CLK: U10.1(TX_CLK) ; port ETH1_TX_CLK
ETH1_TX_EN: U10.2(TX_EN) ; port ETH1_TX_EN
ETH1_TXD0: U10.3(TXD_0) ; port ETH1_TXD0
ETH1_TXD1: U10.4(TXD_1) ; port ETH1_TXD1
ETH1_TXD2: U10.5(TXD_2) ; port ETH1_TXD2
ETH1_TXD3: U10.6(TXD_3) ; port ETH1_TXD3
RX0+: J9.1(RX+) R33.1 U9.5(RX+) ; port RX0+
RX0-: J9.2(RX-) R34.1 U9.4(RX-) ; port RX0-
RX1+: J9.13(RX+) R42.1 U10.14(RD+) ; port RX1+
RX1-: J9.14(RX-) R43.1 U10.13(RD-) ; port RX1-
TX0+: J9.3(TX+) R35.1 U9.7(TX+) ; port TX0+
TX0-: J9.6(TX-) R36.1 U9.6(TX-) ; port TX0-
TX1+: J9.15(TX+) R44.1 U10.17(TD+) ; port TX1+
TX1-: J9.18(TX-) R45.1 U10.16(TD-) ; port TX1-
NetC74_2: C74.2 C75.2 U9.2(VDDPLL_1.8)
NetC76_1: C76.1 C77.1 J9.4(RCT) J9.5(TCT)
NetC78_2: C78.2 C80.2 L1.1 U9.3(VDDA_3.3)
NetC79_2: C79.2 D1.1(A) D2.1(A) R31.1 U9.32(~{RST})
NetC81_1: C81.1 U8.1(CTRL) U8.4(VDC)
NetC82_2: C82.2 C83.2 L1.2 U9.17(VDDIO_3.3)
NetC84_1: C84.1 R33.2 R34.2 R37.1
NetC85_1: C85.1 R35.2 R36.2 R38.1
NetC89_1: C89.1 C90.1 J9.16(RCT) J9.17(TCT)
NetC91_2: C91.2 C92.2 C93.2 L2.2 U10.48(IO_VDD)
NetC94_1: C94.1 R42.2 R43.2 R46.1
NetC95_1: C95.1 R44.2 R45.2 R47.1
NetC96_2: C96.2 C97.2 C98.2
NetD2_3: D2.3(K) R31.2
NetJ9_9: J9.9(LEDL_A) R29.1
NetJ9_11: J9.11(LEDR_A) R30.1
NetJ9_21: J9.21(LEDL_A) R40.1
NetJ9_23: J9.23(LEDR_A) R41.1
NetR39_2: R39.2 U9.10(REXT)
NetR48_2: R48.2 U10.20(VREF)

Not connected (* = marked no-connect by the designer): D1 2(NC); D2 2(NC); J9 7 19 28 29; R29 2; R30 2; R32 2; R37 2; R38 2; R40 2; R41 2; R46 2; R47 2; R49 2; R50 2; U9 8(XO); U10 8(TCK) 9(TDO) 10(TMS) 11(~{TRST}) 12(TDI) 19(ANA33VDD) 26(LED_ACT) 32(IO_VDD) 33(X2)

### Notes on the sheet
- 2 x Ethernet
- Ethernet controller 1
- (near L2) Ethernet controller 2 (with PTP)
- TX_CLK and RX_CLK must be longer
  than other signals on MII.
- Decoupling close to VDD Pins
- Ethernet connector 2
- Ethernet connector 1
- DES
- HES-SO // Valais Wallis
- HAUTE ECOLE VALAISANNE
- /
- REV
- {Path}

### Library data of the parts
C74 C75 C78 C79 C81 C82 C84-C88 C91-C98 = CAPS0805-MM: Capacitor
C76 C77 C89 C90 = CAPS0805-MM: Capacitor; Partition: Shared IOs; RefDes2: {RefDes2}
C80 C83 = CAPS1206-MM: Capacitor
J9 = RJ45-PULSE-J8064D628ANL: Integrated connector modules 10/100 base-TX belMag with LEDs .  Reselec N° 0810-1X1T-03
L1 L2 = L-0805-MM: Self de choc SMD - Murata
PT8 = PTEST_VARIANT_1: Partition: Power; RefDes2: {RefDes2}; Value: *
R31 R32 R49 R50 = RS0805-MM: Partition: FPGA Config; RefDes2: {RefDes2}; MEZZAONLY: YES
R39 = RS0805-MM: Resistor
U8 = OSCILL-VX3: Oscillator serie VX3 - Jauch - Distrelec 68 03 82 .. 68 04 00
U9 = KSZ8041NL: Quadrature Decoder/Counter interface ICs - Agilent Technologies
U10 = DP83640: Value: *

## Sheet UART.SCHDOC: FPGA Rack
size 420 x 297 mm; DrawnBy: zas; Revision: V1.0; SheetNumber: 12; SheetTotal: 25; DocumentName: UART.SCHDOC
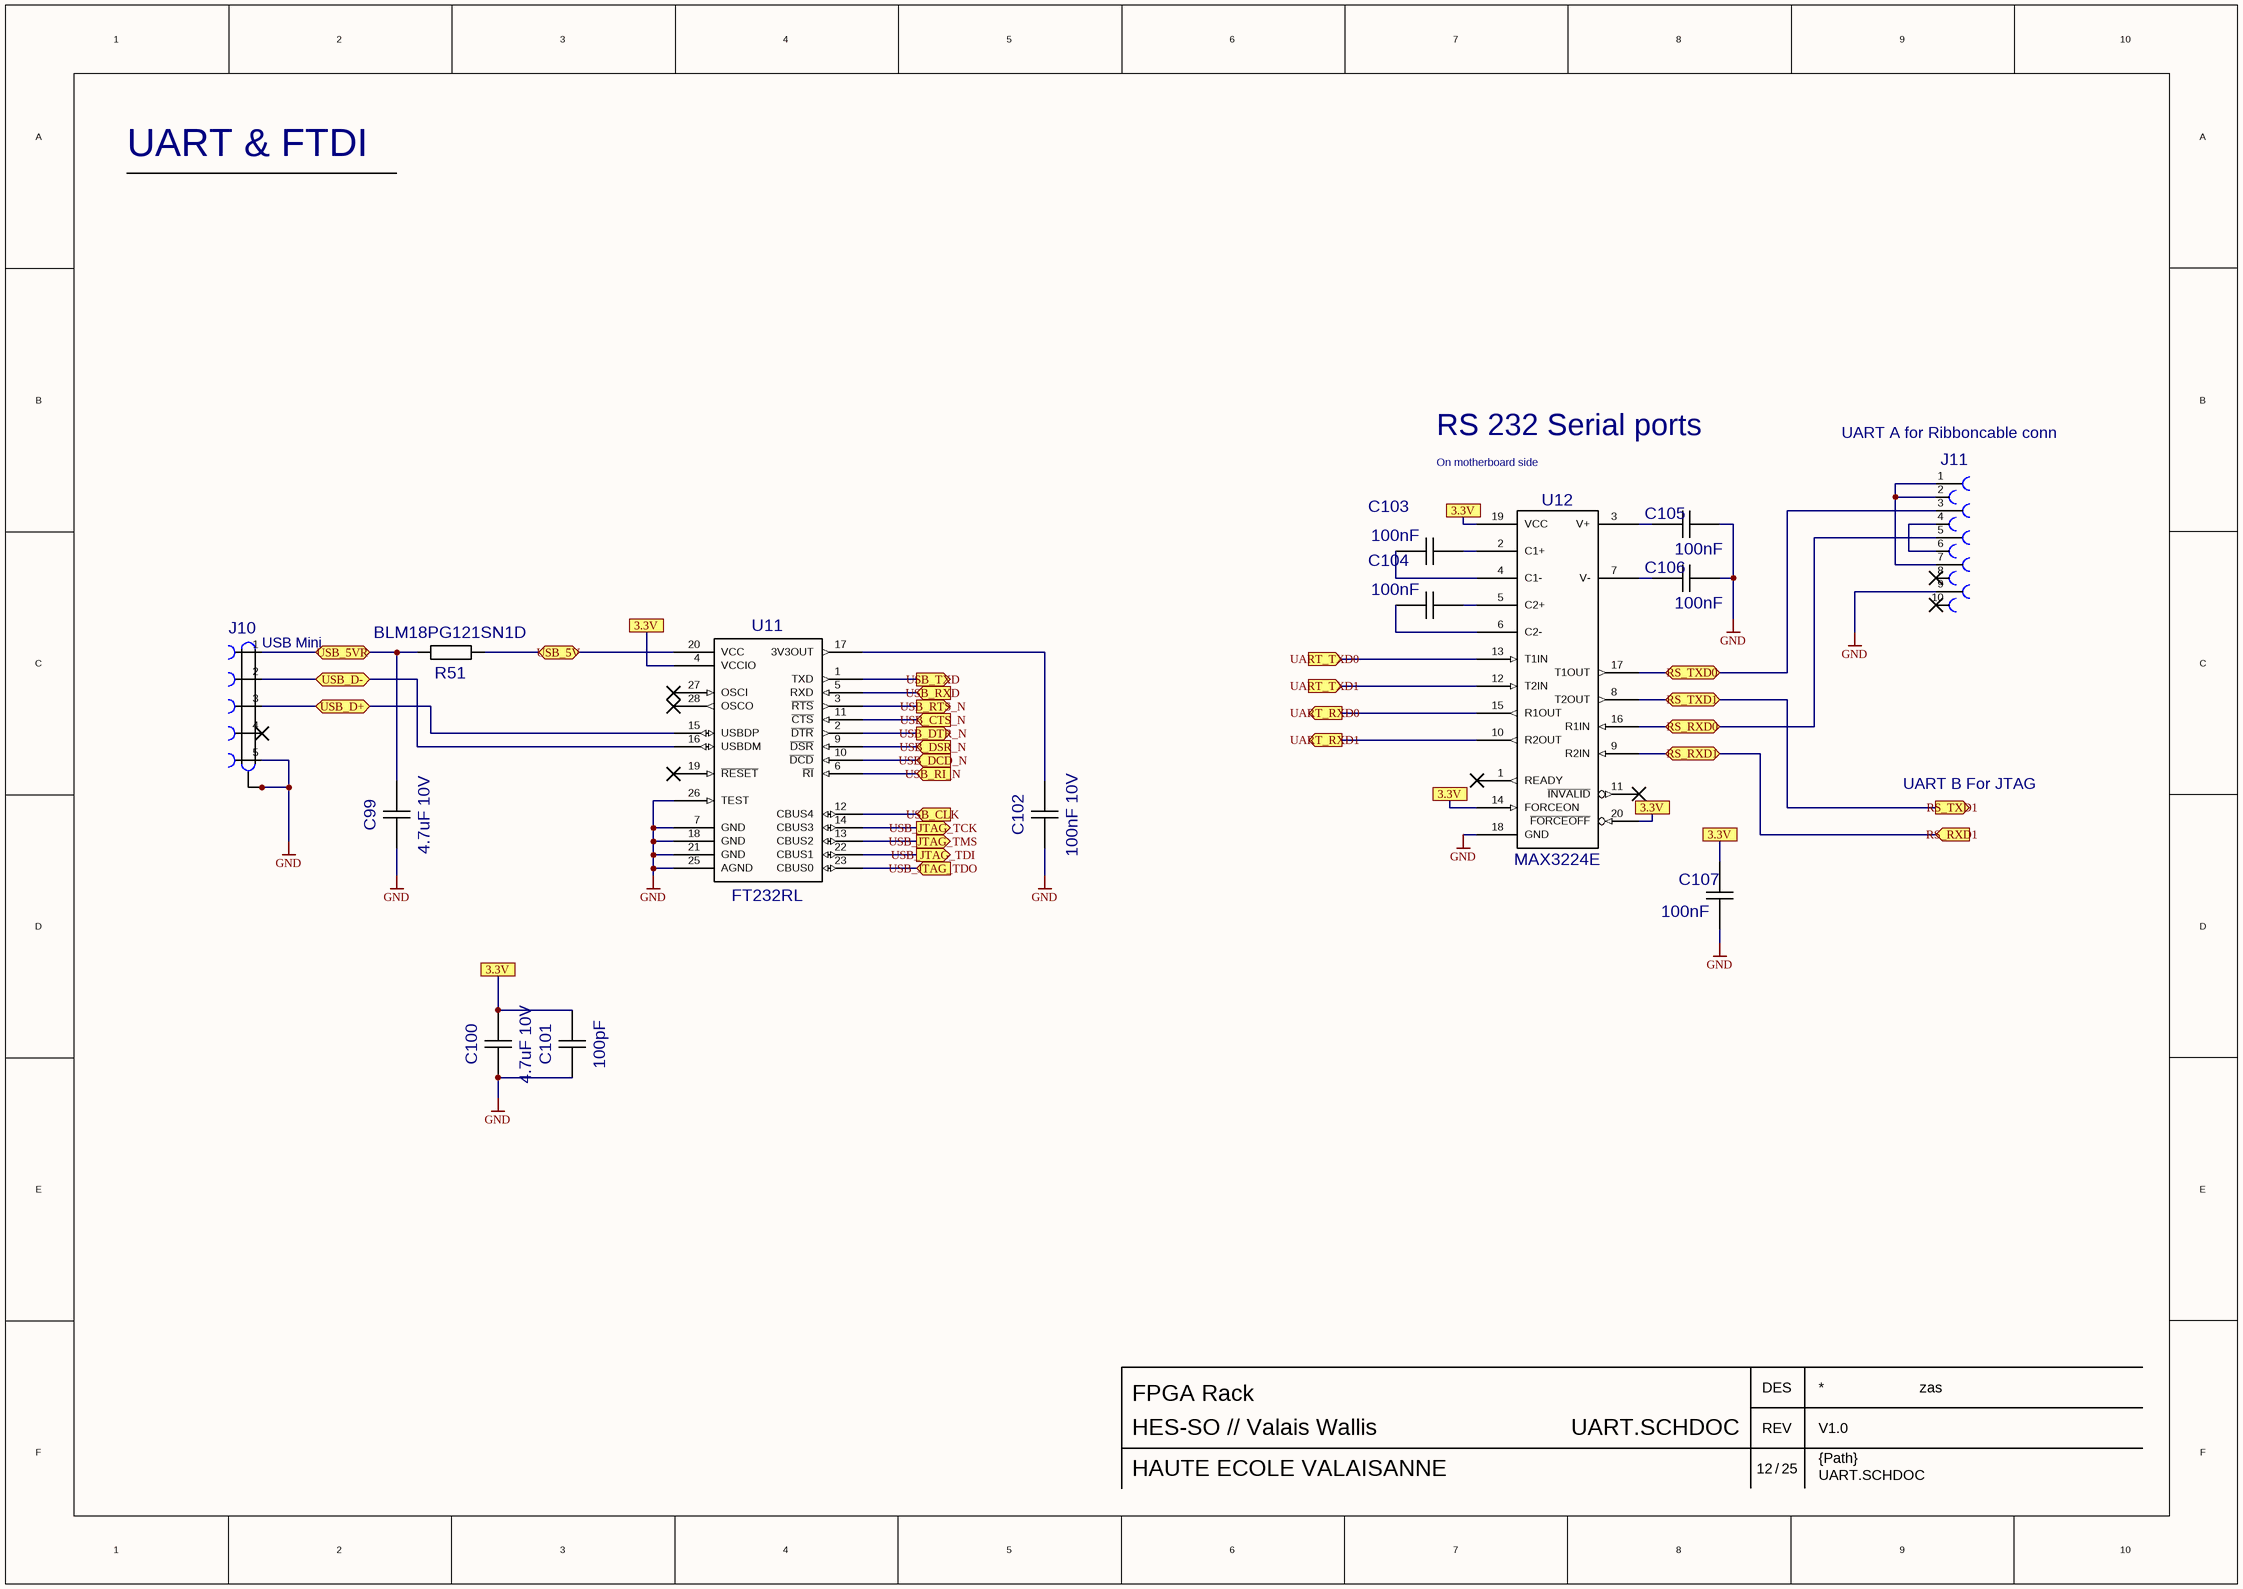
[diagram p11: UART.SCHDOC]

### Parts
C99  value 4.7uF 10V  [CC0805-MM]  (hidden comment: CAPS0805-MM)
C100  value 4.7uF 10V  [CC0805-MM]  (hidden comment: CAPS0805-MM)
C101  value 100pF  [CC0805-MM]  (hidden comment: CAPS0805-MM)
C102  value 100nF 10V  [CC0805-MM]  (hidden comment: CAPS0805-MM)
C103  value 100nF  [CC0805-MM]  (hidden comment: CAPS0805-MM)
C104  value 100nF  [CC0805-MM]  (hidden comment: CAPS0805-MM)
C105  value 100nF  [CC0805-MM]  (hidden comment: CAPS0805-MM)
C106  value 100nF  [CC0805-MM]  (hidden comment: CAPS0805-MM)
C107  value 100nF  [CC0805-MM]  (hidden comment: CAPS0805-MM)
J10  value USB Mini  [USB-MINI-B-SMD]  (hidden comment: USB-MINI-B-SMD)
J11  CONNB2X5  [CONN2X5]  (value not drawn)
R51  value BLM18PG121SN1D  [RC0603-MM]  (hidden comment: RS0603-MM)
U11  FT232RL  [SSOP28-P0.65-L10.2-C5.4]
U12  MAX3224E  [SSOP20]

### Ports
3.3V, RS_RXD0 (bidir), RS_RXD1 (bidir), RS_RXD1 (in), RS_TXD0 (bidir), RS_TXD1 (bidir), RS_TXD1 (out), UART_RXD0 (out), UART_RXD1 (out), UART_TXD0 (in), UART_TXD1 (in), USB_5V (bidir), USB_5VR (bidir), USB_CLK (in), USB_CTS_N (in), USB_D+ (bidir), USB_D- (bidir), USB_DCD_N (in), USB_DSR_N (in), USB_DTR_N (out), USB_JTAG_TCK (out), USB_JTAG_TDI (out), USB_JTAG_TDO (in), USB_JTAG_TMS (out), USB_RI_N (in), USB_RTS_N (out), USB_RXD (in), USB_TXD (out)

### Nets
GND: C99.1 C100.1 C101.1 C102.1 C105.2 C106.2 C107.1 J10.5(GND) J10.6(CASE) J10.7(CASE) J10.8(CASE) J10.9(CASE) J11.9 U11.7(GND) U11.18(GND) U11.21(GND) U11.25(AGND) U11.26(TEST) U12.18(GND)
RS_RXD0: J11.5 U12.16(R1IN) ; port RS_RXD0
RS_RXD1: U12.9(R2IN) ; port RS_RXD1
RS_TXD0: J11.3 U12.17(T1OUT) ; port RS_TXD0
RS_TXD1: U12.8(T2OUT) ; port RS_TXD1
UART_RXD0: U12.15(R1OUT) ; port UART_RXD0
UART_RXD1: U12.10(R2OUT) ; port UART_RXD1
UART_TXD0: U12.13(T1IN) ; port UART_TXD0
UART_TXD1: U12.12(T2IN) ; port UART_TXD1
USB_5V: R51.1 U11.20(VCC) ; port USB_5V
USB_5VR: C99.2 J10.1(VBUS) R51.2 ; port USB_5VR
USB_CLK: U11.12(CBUS4) ; port USB_CLK
USB_CTS_N: U11.11(~{CTS}) ; port USB_CTS_N
USB_D+: J10.3(D+) U11.15(USBDP) ; port USB_D+
USB_D-: J10.2(D-) U11.16(USBDM) ; port USB_D-
USB_DCD_N: U11.10(~{DCD}) ; port USB_DCD_N
USB_DSR_N: U11.9(~{DSR}) ; port USB_DSR_N
USB_DTR_N: U11.2(~{DTR}) ; port USB_DTR_N
USB_JTAG_TCK: U11.14(CBUS3) ; port USB_JTAG_TCK
USB_JTAG_TDI: U11.22(CBUS1) ; port USB_JTAG_TDI
USB_JTAG_TDO: U11.23(CBUS0) ; port USB_JTAG_TDO
USB_JTAG_TMS: U11.13(CBUS2) ; port USB_JTAG_TMS
USB_RI_N: U11.6(~{RI}) ; port USB_RI_N
USB_RTS_N: U11.3(~{RTS}) ; port USB_RTS_N
USB_RXD: U11.5(RXD) ; port USB_RXD
USB_TXD: U11.1(TXD) ; port USB_TXD
NetC100_2: C100.2 C101.2
NetC102_2: C102.2 U11.17(3V3OUT)
NetC103_1: C103.1 U12.4(C1-)
NetC103_2: C103.2 U12.2(C1+)
NetC104_1: C104.1 U12.6(C2-)
NetC104_2: C104.2 U12.5(C2+)
NetC105_1: C105.1 U12.3(V+)
NetC106_1: C106.1 U12.7(V-)
NetJ11_1: J11.1 J11.2 J11.7
NetJ11_4: J11.4 J11.6

Not connected (* = marked no-connect by the designer): C107 2; J10 4(ID) 10 11; J11 8 10; U11 4(VCCIO) 8 19(~{RESET}) 24 27(OSCI) 28(OSCO); U12 1(READY) 11(~{INVALID}) 14(FORCEON) 19(VCC) 20(~{FORCEOFF})

### Notes on the sheet
- UART & FTDI
- RS 232 Serial ports
- (near J11) UART A for Ribboncable conn
- On motherboard side
- UART B For JTAG
- DES
- HES-SO // Valais Wallis
- HAUTE ECOLE VALAISANNE
- /
- REV
- {Path}

### Library data of the parts
C99-C102 = CAPS0805-MM: Capacitor
C103-C107 = CAPS0805-MM: as C76 on sheet Ethernet
J10 = USB-MINI-B-SMD: Farnell no 1125-348 / Molex SD-67503-010
J11 = CONNB2X5: use: cpu jtag; Value: *
U11 = FT232RL: 24-Bit ADC with Ultra Low Noise PGIA - Crystal; Value: FT232RL
U12 = MAX3224E: +/- 15kV ESD-Protected, 1uA, 1Mbps, 3.0V to 5.5V, RS-232 Transceiver with AutoShutdown Plus; Partition: Shared IOs; RefDes2: {RefDes2}; Value: *

## Sheet Sheet13.SCHDOC: FPGA Rack
size 420 x 297 mm; DrawnBy: zas; Revision: V1.0; SheetNumber: 13; SheetTotal: 25; DocumentName: Sheet13.SCHDOC

### Notes on the sheet
- DES
- HES-SO // Valais Wallis
- HAUTE ECOLE VALAISANNE
- /
- REV
- {Path}

## Sheet Sheet14.SCHDOC: FPGA Rack
size 420 x 297 mm; DrawnBy: zas; Revision: V1.0; SheetNumber: 14; SheetTotal: 25; DocumentName: Sheet14.SCHDOC

### Notes on the sheet
- DES
- HES-SO // Valais Wallis
- HAUTE ECOLE VALAISANNE
- /
- REV
- {Path}

## Sheet Sheet15.SCHDOC: FPGA Rack
size 420 x 297 mm; DrawnBy: zas; Revision: V1.0; SheetNumber: 15; SheetTotal: 25; DocumentName: Sheet15.SCHDOC

### Notes on the sheet
- DES
- HES-SO // Valais Wallis
- HAUTE ECOLE VALAISANNE
- /
- REV
- {Path}

## Sheet Sheet16.SCHDOC: FPGA Rack
size 420 x 297 mm; DrawnBy: zas; Revision: V1.0; SheetNumber: 16; SheetTotal: 25; DocumentName: Sheet16.SCHDOC

### Notes on the sheet
- DES
- HES-SO // Valais Wallis
- HAUTE ECOLE VALAISANNE
- /
- REV
- {Path}

## Sheet Sheet17.SCHDOC: FPGA Rack
size 420 x 297 mm; DrawnBy: zas; Revision: V1.0; SheetNumber: 17; SheetTotal: 25; DocumentName: Sheet17.SCHDOC

### Notes on the sheet
- DES
- HES-SO // Valais Wallis
- HAUTE ECOLE VALAISANNE
- /
- REV
- {Path}

## Sheet Sheet18.SCHDOC: FPGA Rack
size 420 x 297 mm; DrawnBy: zas; Revision: V1.0; SheetNumber: 18; SheetTotal: 25; DocumentName: Sheet18.SCHDOC

### Notes on the sheet
- DES
- HES-SO // Valais Wallis
- HAUTE ECOLE VALAISANNE
- /
- REV
- {Path}

## Sheet Sheet19.SCHDOC: FPGA Rack
size 420 x 297 mm; DrawnBy: zas; Revision: V1.0; SheetNumber: 19; SheetTotal: 25; DocumentName: Sheet19.SCHDOC

### Notes on the sheet
- DES
- HES-SO // Valais Wallis
- HAUTE ECOLE VALAISANNE
- /
- REV
- {Path}

## Sheet Sheet20.SCHDOC: FPGA Rack
size 420 x 297 mm; DrawnBy: zas; Revision: V1.0; SheetNumber: 20; SheetTotal: 25; DocumentName: Sheet20.SCHDOC

### Notes on the sheet
- DES
- HES-SO // Valais Wallis
- HAUTE ECOLE VALAISANNE
- /
- REV
- {Path}

## Sheet Sheet21.SCHDOC: FPGA Rack
size 420 x 297 mm; DrawnBy: zas; Revision: V1.0; SheetNumber: 21; SheetTotal: 25; DocumentName: Sheet21.SCHDOC

### Notes on the sheet
- DES
- HES-SO // Valais Wallis
- HAUTE ECOLE VALAISANNE
- /
- REV
- {Path}

## Sheet Sheet22.SCHDOC: FPGA Rack
size 420 x 297 mm; DrawnBy: zas; Revision: V1.0; SheetNumber: 22; SheetTotal: 25; DocumentName: Sheet22.SCHDOC

### Notes on the sheet
- DES
- HES-SO // Valais Wallis
- HAUTE ECOLE VALAISANNE
- /
- REV
- {Path}

## Sheet Sheet23.SCHDOC: FPGA Rack
size 420 x 297 mm; DrawnBy: zas; Revision: V1.0; SheetNumber: 23; SheetTotal: 25; DocumentName: Sheet23.SCHDOC

### Notes on the sheet
- DES
- HES-SO // Valais Wallis
- HAUTE ECOLE VALAISANNE
- /
- REV
- {Path}

## Sheet Sheet24.SCHDOC: FPGA Rack
size 420 x 297 mm; DrawnBy: zas; Revision: V1.0; SheetNumber: 24; SheetTotal: 25; DocumentName: Sheet24.SCHDOC

### Notes on the sheet
- DES
- HES-SO // Valais Wallis
- HAUTE ECOLE VALAISANNE
- /
- REV
- {Path}

## Sheet Sheet25.SCHDOC: FPGA Rack
size 420 x 297 mm; DrawnBy: zas; Revision: V1.0; SheetNumber: 25; SheetTotal: 25; DocumentName: Sheet25.SCHDOC

### Notes on the sheet
- DES
- HES-SO // Valais Wallis
- HAUTE ECOLE VALAISANNE
- /
- REV
- {Path}

## Nets that join several sheets
GND: Power (93 pins), FPGA Power (105 pins), FPGA 1 (C59.1 R7.1 U3.AA22 U3.U15), FPGA Config (15 pins), Memory (25 pins), Mezzanine (26 pins), Ethernet (39 pins), UART (19 pins)
CLK_25M: FPGA 2 (U3.K20), Ethernet (PT8.1 U8.3 U9.9 U10.34)
CLK_106_25M: FPGA 2 (U3.L19), FPGA Config (PT7.1 U4.3)
CS_SDRAM_N: FPGA 1 (U3.B16), Memory (R28.1 U7.19)
ETH0_COL: FPGA 1 (U3.R13), Ethernet (U9.28)
ETH0_CRS: FPGA 1 (U3.V13), Ethernet (U9.29)
ETH0_INTRP: FPGA 1 (U3.R15), Ethernet (U9.21)
ETH0_MDC: FPGA 1 (U3.Y12), Ethernet (U9.12)
ETH0_MDIO: FPGA 1 (U3.T16), Ethernet (R32.1 U9.11)
ETH0_RESET_N: FPGA 1 (U3.Y15), Ethernet (D1.3)
ETH0_RX_CLK: FPGA 1 (U3.Y11), Ethernet (U9.19)
ETH0_RX_DV: FPGA 1 (U3.AB14), Ethernet (U9.18)
ETH0_RX_ER: FPGA 1 (U3.AB7), Ethernet (U9.20)
ETH0_RXD0: FPGA 1 (U3.AA14), Ethernet (U9.16)
ETH0_RXD1: FPGA 1 (U3.AB15), Ethernet (U9.15)
ETH0_RXD2: FPGA 1 (U3.AB16), Ethernet (U9.14)
ETH0_RXD3: FPGA 1 (U3.AA16), Ethernet (U9.13)
ETH0_TX_CLK: FPGA 1 (U3.AB11), Ethernet (U9.22)
ETH0_TX_EN: FPGA 1 (U3.T15), Ethernet (U9.23)
ETH0_TXD0: FPGA 1 (U3.U16), Ethernet (U9.24)
ETH0_TXD1: FPGA 1 (U3.T14), Ethernet (U9.25)
ETH0_TXD2: FPGA 1 (U3.Y14), Ethernet (U9.26)
ETH0_TXD3: FPGA 1 (U3.W14), Ethernet (U9.27)
ETH1_CLK_OUT: FPGA 2 (U3.H21), Ethernet (U10.24)
ETH1_COL: FPGA 1 (U3.V18), Ethernet (U10.42)
ETH1_CRS: FPGA 1 (U3.AB19), Ethernet (U10.40)
ETH1_GPIO1: FPGA 2 (U3.V22), Ethernet (U10.21)
ETH1_GPIO2: FPGA 2 (U3.V21), Ethernet (U10.22)
ETH1_GPIO3: FPGA 2 (U3.W20), Ethernet (U10.23)
ETH1_GPIO4: FPGA 2 (U3.W22), Ethernet (U10.25)
ETH1_GPIO8: FPGA 1 (U3.AA21), Ethernet (U10.36)
ETH1_GPIO9: FPGA 1 (U3.AB21), Ethernet (U10.37)
ETH1_MDC: FPGA 2 (U3.H22), Ethernet (U10.31)
ETH1_MDIO: FPGA 1 (U3.Y19), Ethernet (R50.1 U10.30)
ETH1_PWR_DOWN_INT: FPGA 2 (U3.K19), Ethernet (U10.7)
ETH1_RESET_N: FPGA 1 (U3.V19), Ethernet (R49.1 U10.29)
ETH1_RX_CLK: FPGA 2 (U3.J20), Ethernet (U10.38)
ETH1_RX_DV: FPGA 1 (U3.AB20), Ethernet (U10.39)
ETH1_RX_ER: FPGA 1 (U3.T18), Ethernet (U10.41)
ETH1_RXD0: FPGA 1 (U3.U17), Ethernet (U10.46)
ETH1_RXD1: FPGA 1 (U3.T17), Ethernet (U10.45)
ETH1_RXD2: FPGA 1 (U3.Y18), Ethernet (U10.44)
ETH1_RXD3: FPGA 1 (U3.W18), Ethernet (U10.43)
ETH1_TX_CLK: FPGA 2 (U3.J22), Ethernet (U10.1)
ETH1_TX_EN: FPGA 1 (U3.V17), Ethernet (U10.2)
ETH1_TXD0: FPGA 1 (U3.W17), Ethernet (U10.3)
ETH1_TXD1: FPGA 1 (U3.Y17), Ethernet (U10.4)
ETH1_TXD2: FPGA 1 (U3.AB17), Ethernet (U10.5)
ETH1_TXD3: FPGA 1 (U3.R16), Ethernet (U10.6)
FLASH_ADV_N: FPGA 2 (U3.G20), Memory (R23.2 U6.46)
FLASH_CE_N: FPGA 2 (U3.M21), Memory (R22.1 U6.30)
FLASH_CLK: FPGA 2 (U3.G17), Memory (R26.1 U6.45)
FLASH_FPGA_RESET_N: FPGA 2 (U3.H17), Memory (R21.1 U5.1)
FLASH_OE_N: FPGA 2 (U3.M22), Memory (R24.1 U6.32)
FLASH_WAIT: FPGA 2 (U3.G22), Memory (R27.1 U6.56)
FLASH_WE_N: FPGA 2 (U3.N20), Memory (R25.1 U6.14)
FPGA_DONE: FPGA 1 (U3.Y22), FPGA Config (LD1.2 R13.2)
FPGA_JTAG_TCK: FPGA Power (U3.G15), FPGA Config (J1.5 JP9.2 R11.1)
FPGA_JTAG_TDI: FPGA Power (U3.E18), FPGA Config (J1.9 JP11.2 R12.1)
FPGA_JTAG_TDO: FPGA Power (U3.A19), FPGA Config (J1.7 JP10.2)
FPGA_JTAG_TMS: FPGA Power (U3.C18), FPGA Config (J1.3 JP8.2 R10.1)
HARDRESET_N: FPGA 1 (U3.AA1), FPGA Config (R15.1 S1.NO), Memory (U5.2)
JTAG_GPIO0: FPGA 2 (U3.R20), FPGA Config (J1.6)
JTAG_GPIO1: FPGA 2 (U3.R19), FPGA Config (J1.8)
MEM_A00: FPGA 2 (U3.L22), Memory (U6.29)
MEM_A01: FPGA 2 (U3.L20), Memory (U6.25)
MEM_A02: FPGA 2 (U3.K22), Memory (U6.24)
MEM_A03: FPGA 2 (U3.K21), Memory (U6.23)
MEM_A04: FPGA 2 (U3.J19), Memory (U6.22)
MEM_A05: FPGA 2 (U3.H20), Memory (U6.21)
MEM_A06: FPGA 2 (U3.F22), Memory (U6.20)
MEM_A07: FPGA 2 (U3.F21), Memory (U6.19)
MEM_A08: FPGA 2 (U3.K17), Memory (U6.8)
MEM_A09: FPGA 2 (U3.J17), Memory (U6.7)
MEM_A10: FPGA 2 (U3.E22), Memory (U6.6)
MEM_A11: FPGA 2 (U3.E20), Memory (U6.5)
MEM_A12: FPGA 2 (U3.H18), Memory (U6.4)
MEM_A13: FPGA 2 (U3.H19), Memory (U6.3)
MEM_A14: FPGA 2 (U3.F20), Memory (U6.2)
MEM_A15: FPGA 2 (U3.G19), Memory (U6.1)
MEM_A16: FPGA 2 (U3.C22), Memory (U6.55)
MEM_A17: FPGA 2 (U3.C20), Memory (U6.18)
MEM_A18: FPGA 2 (U3.D22), Memory (U6.17)
MEM_A19: FPGA 2 (U3.D21), Memory (U6.16)
MEM_A20: FPGA 2 (U3.F19), Memory (U6.11)
MEM_A21: FPGA 2 (U3.F18), Memory (U6.10)
MEM_A22: FPGA 2 (U3.D20), Memory (U6.9)
MEM_A23: FPGA 2 (U3.D19), Memory (U6.26)
MEM_A24: FPGA 2 (U3.B20), Memory (U6.27)
MEM_D00: FPGA 1 (U3.AA20), Memory (U6.34)
MEM_D01: FPGA 1 (U3.U14), Memory (U6.36)
MEM_D02: FPGA 1 (U3.U13), Memory (U6.39)
MEM_D03: FPGA 1 (U3.AA6), Memory (U6.41)
MEM_D04: FPGA 1 (U3.AB6), Memory (U6.47)
MEM_D05: FPGA 1 (U3.W4), Memory (U6.49)
MEM_D06: FPGA 1 (U3.Y4), Memory (U6.51)
MEM_D07: FPGA 1 (U3.Y7), Memory (U6.53)
MEM_D08: FPGA 1 (U3.AA2), Memory (U6.35)
MEM_D09: FPGA 1 (U3.AB2), Memory (U6.37)
MEM_D10: FPGA 1 (U3.V15), Memory (U6.40)
MEM_D11: FPGA 1 (U3.AA18), Memory (U6.42)
MEM_D12: FPGA 1 (U3.AB18), Memory (U6.48)
MEM_D13: FPGA 1 (U3.Y13), Memory (U6.50)
MEM_D14: FPGA 1 (U3.AA12), Memory (U6.52)
MEM_D15: FPGA 1 (U3.AB12), Memory (U6.54)
MEZ_12MHZ: FPGA 1 (U3.C11), Mezzanine (J2.b25 J3.b25)
MEZ_24MHZ: FPGA 2 (U3.M20), Mezzanine (J4.b25 J5.b25)
MEZ_A00: FPGA 2 (U3.K18), Mezzanine (J2.a2 J3.a2)
MEZ_A01: FPGA 1 (U3.A15), Memory (U7.23), Mezzanine (J2.b2 J3.b2)
MEZ_A02: FPGA 1 (U3.D14), Memory (U7.24), Mezzanine (J2.a3 J3.a3)
MEZ_A03: FPGA 1 (U3.C14), Memory (U7.25), Mezzanine (J2.b3 J3.b3)
MEZ_A04: FPGA 1 (U3.B14), Memory (U7.26), Mezzanine (J2.a4 J3.a4)
MEZ_A05: FPGA 1 (U3.A14), Memory (U7.29), Mezzanine (J2.b4 J3.b4)
MEZ_A06: FPGA 1 (U3.A13), Memory (U7.30), Mezzanine (J2.a5 J3.a5)
MEZ_A07: FPGA 1 (U3.C13), Memory (U7.31), Mezzanine (J2.b5 J3.b5)
MEZ_A08: FPGA 1 (U3.A12), Memory (U7.32), Mezzanine (J2.a6 J3.a6)
MEZ_A09: FPGA 1 (U3.B12), Memory (U7.33), Mezzanine (J2.b6 J3.b6)
MEZ_A10: FPGA 1 (U3.D11), Memory (U7.34), Mezzanine (J4.a18 J5.a18)
MEZ_A11: FPGA 1 (U3.C15), Memory (U7.22), Mezzanine (J4.b18 J5.b18)
MEZ_A12: FPGA 1 (U3.A11), Memory (U7.35), Mezzanine (J4.a19 J5.a19)
MEZ_A13: FPGA 1 (U3.C10), Memory (U7.36), Mezzanine (J4.b19 J5.b19)
MEZ_A14: FPGA 1 (U3.A16), Memory (U7.20), Mezzanine (J4.a20 J5.a20)
MEZ_A15: FPGA 1 (U3.D15), Memory (U7.21), Mezzanine (J4.b20 J5.b20)
MEZ_A16: FPGA 1 (U3.R7), Mezzanine (J4.a21 J5.a21)
MEZ_A17: FPGA 1 (U3.T7), Mezzanine (J4.b21 J5.b21)
MEZ_A18: FPGA 1 (U3.U6), Mezzanine (J4.a22 J5.a22)
MEZ_A19: FPGA 1 (U3.V5), Mezzanine (J4.b22 J5.b22)
MEZ_A20: FPGA 1 (U3.AB4), Mezzanine (J4.a23 J5.a23)
MEZ_A21: FPGA 1 (U3.AA4), Mezzanine (J4.b23 J5.b23)
MEZ_A22: FPGA 1 (U3.AB3), Mezzanine (J4.a24 J5.a24)
MEZ_A23: FPGA 1 (U3.Y3), Mezzanine (J4.b24 J5.b24)
MEZ_D00: FPGA 2 (U3.A21), Memory (U7.2), Mezzanine (J2.a11 J3.a11)
MEZ_D01: FPGA 2 (U3.B21), Memory (U7.4), Mezzanine (J2.b11 J3.b11)
MEZ_D02: FPGA 2 (U3.A20), Memory (U7.5), Mezzanine (J2.a12 J3.a12)
MEZ_D03: FPGA 1 (U3.D17), Memory (U7.7), Mezzanine (J2.b12 J3.b12)
MEZ_D04: FPGA 2 (U3.F17), Memory (U7.8), Mezzanine (J2.a13 J3.a13)
MEZ_D05: FPGA 2 (U3.F16), Memory (U7.10), Mezzanine (J2.b13 J3.b13)
MEZ_D06: FPGA 1 (U3.B18), Memory (U7.11), Mezzanine (J2.a14 J3.a14)
MEZ_D07: FPGA 1 (U3.A18), Memory (U7.13), Mezzanine (J2.b14 J3.b14)
MEZ_D08: FPGA 1 (U3.D9), Memory (U7.42), Mezzanine (J2.a15 J3.a15)
MEZ_D09: FPGA 1 (U3.C9), Memory (U7.44), Mezzanine (J2.b15 J3.b15)
MEZ_D10: FPGA 1 (U3.A9), Memory (U7.45), Mezzanine (J2.a16 J3.a16)
MEZ_D11: FPGA 1 (U3.D8), Memory (U7.47), Mezzanine (J2.b16 J3.b16)
MEZ_D12: FPGA 1 (U3.C8), Memory (U7.48), Mezzanine (J2.a17 J3.a17)
MEZ_D13: FPGA 1 (U3.A8), Memory (U7.50), Mezzanine (J2.b17 J3.b17)
MEZ_D14: FPGA 1 (U3.B8), Memory (U7.51), Mezzanine (J2.a18 J3.a18)
MEZ_D15: FPGA 1 (U3.D7), Memory (U7.53), Mezzanine (J2.b18 J3.b18)
MEZ_NCS3: FPGA 2 (U3.K16), Mezzanine (J2.a8 J3.a8)
MEZ_NCS4: FPGA 2 (U3.J16), Mezzanine (J2.b8 J3.b8)
MEZ_NCS5: FPGA 2 (U3.H16), Mezzanine (J2.a9 J3.a9)
MEZ_NCS6: FPGA 2 (U3.G16), Mezzanine (J2.b9 J3.b9)
MEZ_NOE/NRD0: FPGA 1 (U3.C7), Mezzanine (J2.b20 J3.b20)
MEZ_NRESET: FPGA 1 (U3.A4), Mezzanine (J2.a25 J3.a25)
MEZ_NUB/NWR1: FPGA 1 (U3.A6), Mezzanine (J2.b21 J3.b21)
MEZ_NWAIT: FPGA 1 (U3.A7), Mezzanine (J2.a20 J3.a20)
MEZ_NWR/NWR0: FPGA 1 (U3.A17), Memory (U7.16), Mezzanine (J2.a21 J3.a21)
MEZ_PA0_MISO: FPGA 1 (U3.W13), Mezzanine (J4.a2 J5.a2)
MEZ_PA1_MOSI: FPGA 1 (U3.R11), Mezzanine (J4.b2 J5.b2)
MEZ_PA2_SPCK: FPGA 1 (U3.W12), Mezzanine (J4.a3 J5.a3)
MEZ_PA5_NPCS2: FPGA 1 (U3.T11), Mezzanine (J4.b3 J5.b3)
MEZ_PA6_NPCS3: FPGA 1 (U3.V11), Mezzanine (J4.a4 J5.a4)
MEZ_PA09/IRQ0: FPGA 1 (U3.B6), Mezzanine (J2.a22 J3.a22)
MEZ_PA10/IRQ1: FPGA 1 (U3.C6), Mezzanine (J2.b22 J3.b22)
MEZ_PA11/IRQ2: FPGA 1 (U3.D6), Mezzanine (J2.a23 J3.a23)
MEZ_PA12/IRQ3: FPGA 1 (U3.A5), Mezzanine (J2.b23 J3.b23)
MEZ_PA13/FIQ: FPGA 1 (U3.C5), Mezzanine (J2.a24 J3.a24)
MEZ_PB1: FPGA 1 (U3.W8), Mezzanine (J4.b13 J5.b13)
MEZ_PB2: FPGA 1 (U3.AB8), Mezzanine (J4.a14 J5.a14)
MEZ_PB6: FPGA 1 (U3.Y10), Mezzanine (J4.a6 J5.a6)
MEZ_PB7: FPGA 1 (U3.W10), Mezzanine (J4.b6 J5.b6)
MEZ_PB8: FPGA 1 (U3.AB10), Mezzanine (J4.a7 J5.a7)
MEZ_PB9: FPGA 1 (U3.AA10), Mezzanine (J4.b7 J5.b7)
MEZ_PB10: FPGA 1 (U3.U9), Mezzanine (J4.b8 J5.b8)
MEZ_PB11: FPGA 1 (U3.R9), Mezzanine (J4.a8 J5.a8)
MEZ_PB14: FPGA 1 (U3.V9), Mezzanine (J4.a9 J5.a9)
MEZ_PB15: FPGA 1 (U3.W9), Mezzanine (J4.b9 J5.b9)
MEZ_PB16: FPGA 1 (U3.Y9), Mezzanine (J4.a10 J5.a10)
MEZ_PB17: FPGA 1 (U3.AB9), Mezzanine (J4.b10 J5.b10)
MEZ_PB18: FPGA 1 (U3.R8), Mezzanine (J4.a11 J5.a11)
MEZ_PB19: FPGA 1 (U3.T8), Mezzanine (J4.b11 J5.b11)
MEZ_PB22: FPGA 1 (U3.Y8), Mezzanine (J4.a13 J5.a13)
MEZ_PD13: FPGA 1 (U3.W11), Mezzanine (J4.b4 J5.b4)
MEZ_PD20: FPGA 1 (U3.AA8), Mezzanine (J4.a16 J5.a16)
MEZ_PD21: FPGA 1 (U3.V7), Mezzanine (J4.b16 J5.b16)
RS_RXD1: FPGA Config (J1.4), UART (U12.9)
RS_TXD1: FPGA Config (J1.2), UART (U12.8)
SD_CKE: FPGA 1 (U3.A10), Memory (U7.37)
SD_CLK: FPGA 1 (U3.C12), Memory (U7.38)
SD_DQMH: FPGA 1 (U3.B10), Memory (U7.39)
SD_DQML: FPGA 1 (U3.C17), Memory (U7.15)
SD_NCAS: FPGA 1 (U3.E16), Memory (U7.17)
SD_NRAS: FPGA 1 (U3.C16), Memory (U7.18)
SOFTRESET_N: FPGA 2 (U3.L15), FPGA Config (R20.1 S2.3 S2.4)
UART_RXD0: FPGA 2 (U3.P19), UART (U12.15)
UART_RXD1: FPGA 2 (U3.N19), UART (U12.10)
UART_TXD0: FPGA 2 (U3.P18), UART (U12.13)
UART_TXD1: FPGA 2 (U3.P17), UART (U12.12)
USB_5V: Power (JP1.1), UART (R51.1 U11.20)
USB_CLK: FPGA 1 (U3.AB13), UART (U11.12)
USB_CTS_N: FPGA 2 (U3.R22), UART (U11.11)
USB_DCD_N: FPGA 2 (U3.T19), UART (U11.10)
USB_DSR_N: FPGA 2 (U3.T22), UART (U11.9)
USB_DTR_N: FPGA 2 (U3.U22), UART (U11.2)
USB_JTAG_TCK: FPGA Config (JP9.1), UART (U11.14)
USB_JTAG_TDI: FPGA Config (JP11.1), UART (U11.22)
USB_JTAG_TDO: FPGA Config (JP10.1), UART (U11.23)
USB_JTAG_TMS: FPGA Config (JP8.1), UART (U11.13)
USB_RI_N: FPGA 2 (U3.T21), UART (U11.6)
USB_RTS_N: FPGA 2 (U3.U20), UART (U11.3)
USB_RXD: FPGA 2 (U3.U19), UART (U11.5)
USB_TXD: FPGA 2 (U3.V20), UART (U11.1)
USER_DIL_0: FPGA 2 (U3.P20), FPGA Config (SW1.8)
USER_DIL_1: FPGA 2 (U3.P22), FPGA Config (SW1.7)
USER_DIL_2: FPGA 2 (U3.N16), FPGA Config (SW1.6)
USER_DIL_3: FPGA 2 (U3.M19), FPGA Config (SW1.5)
USER_LED_0: FPGA 2 (U3.M17), FPGA Config (R16.1)
USER_LED_1: FPGA 2 (U3.M18), FPGA Config (R17.1)
USER_LED_2: FPGA 2 (U3.M16), FPGA Config (R18.1)
USER_LED_3: FPGA 2 (U3.L17), FPGA Config (R19.1)